# EAGLE design routed-micromouse-board (EAGLE 9.4.2)
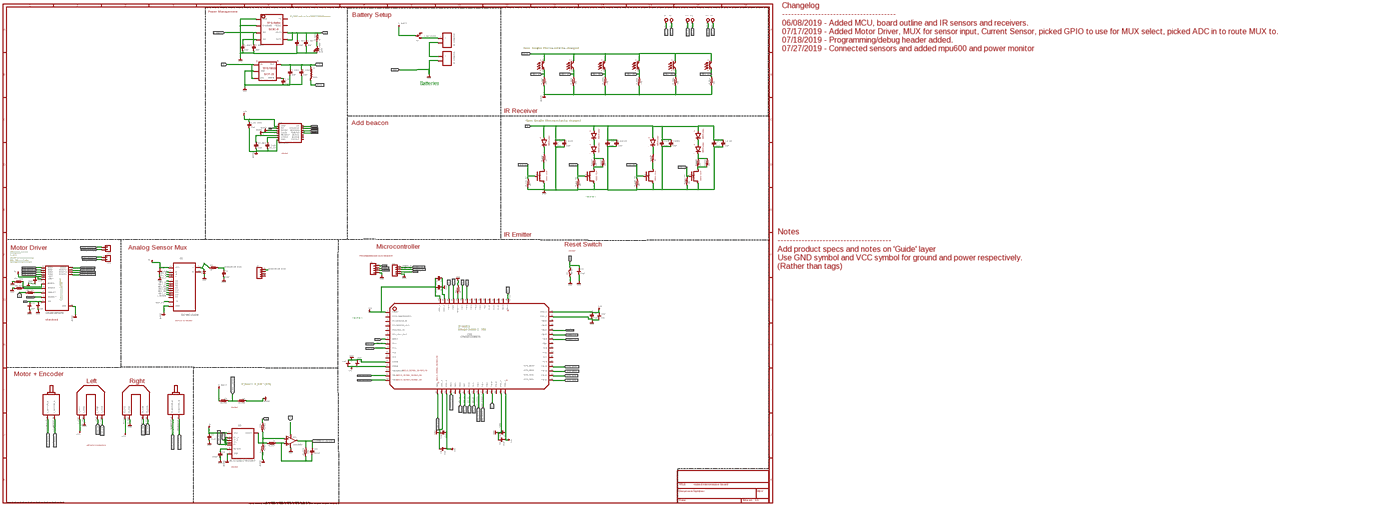
[diagram p0: schematic, sheet 1, overview]
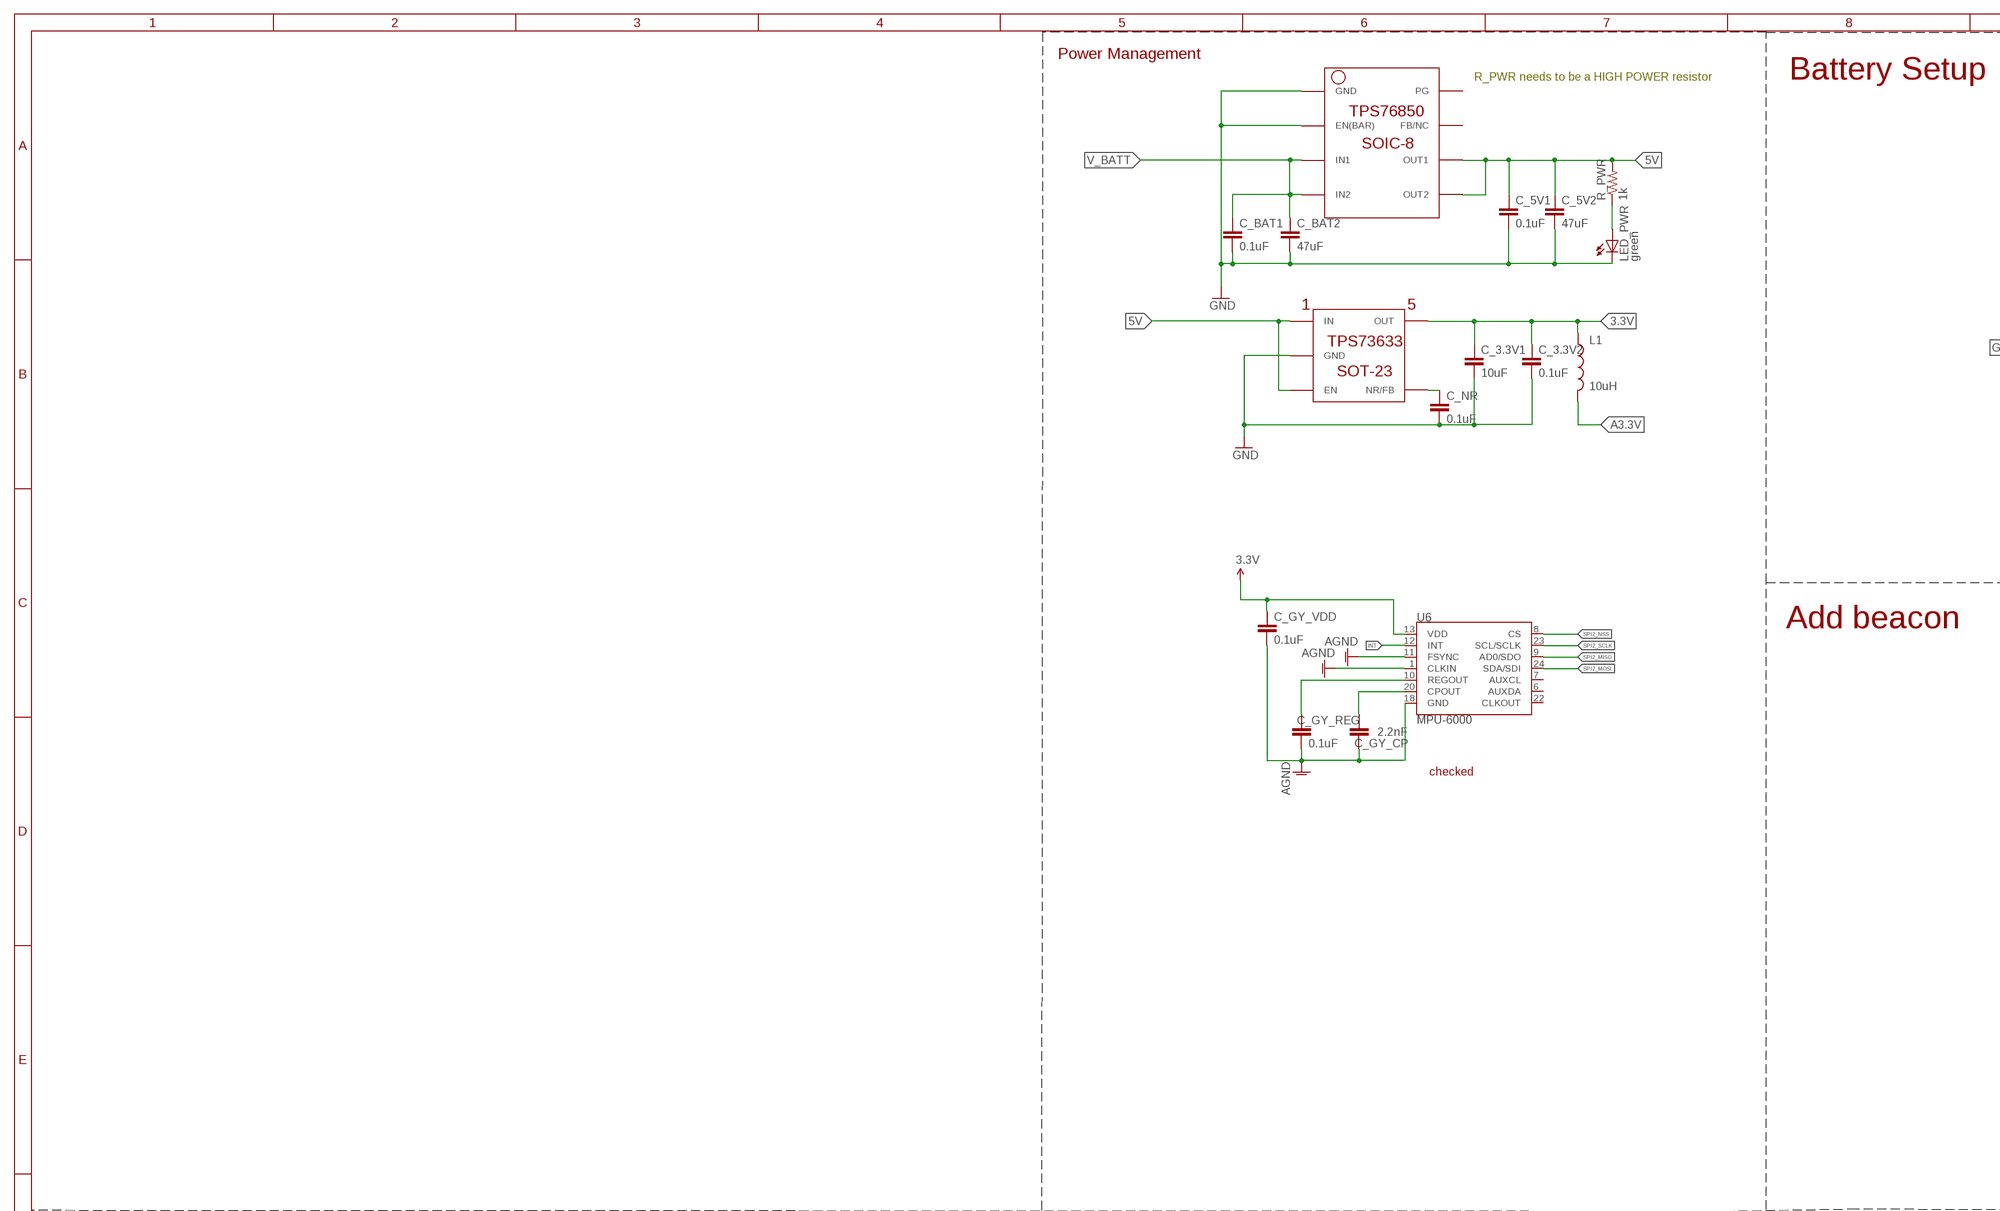
[diagram p1: schematic, sheet 1, part 1 of 6]
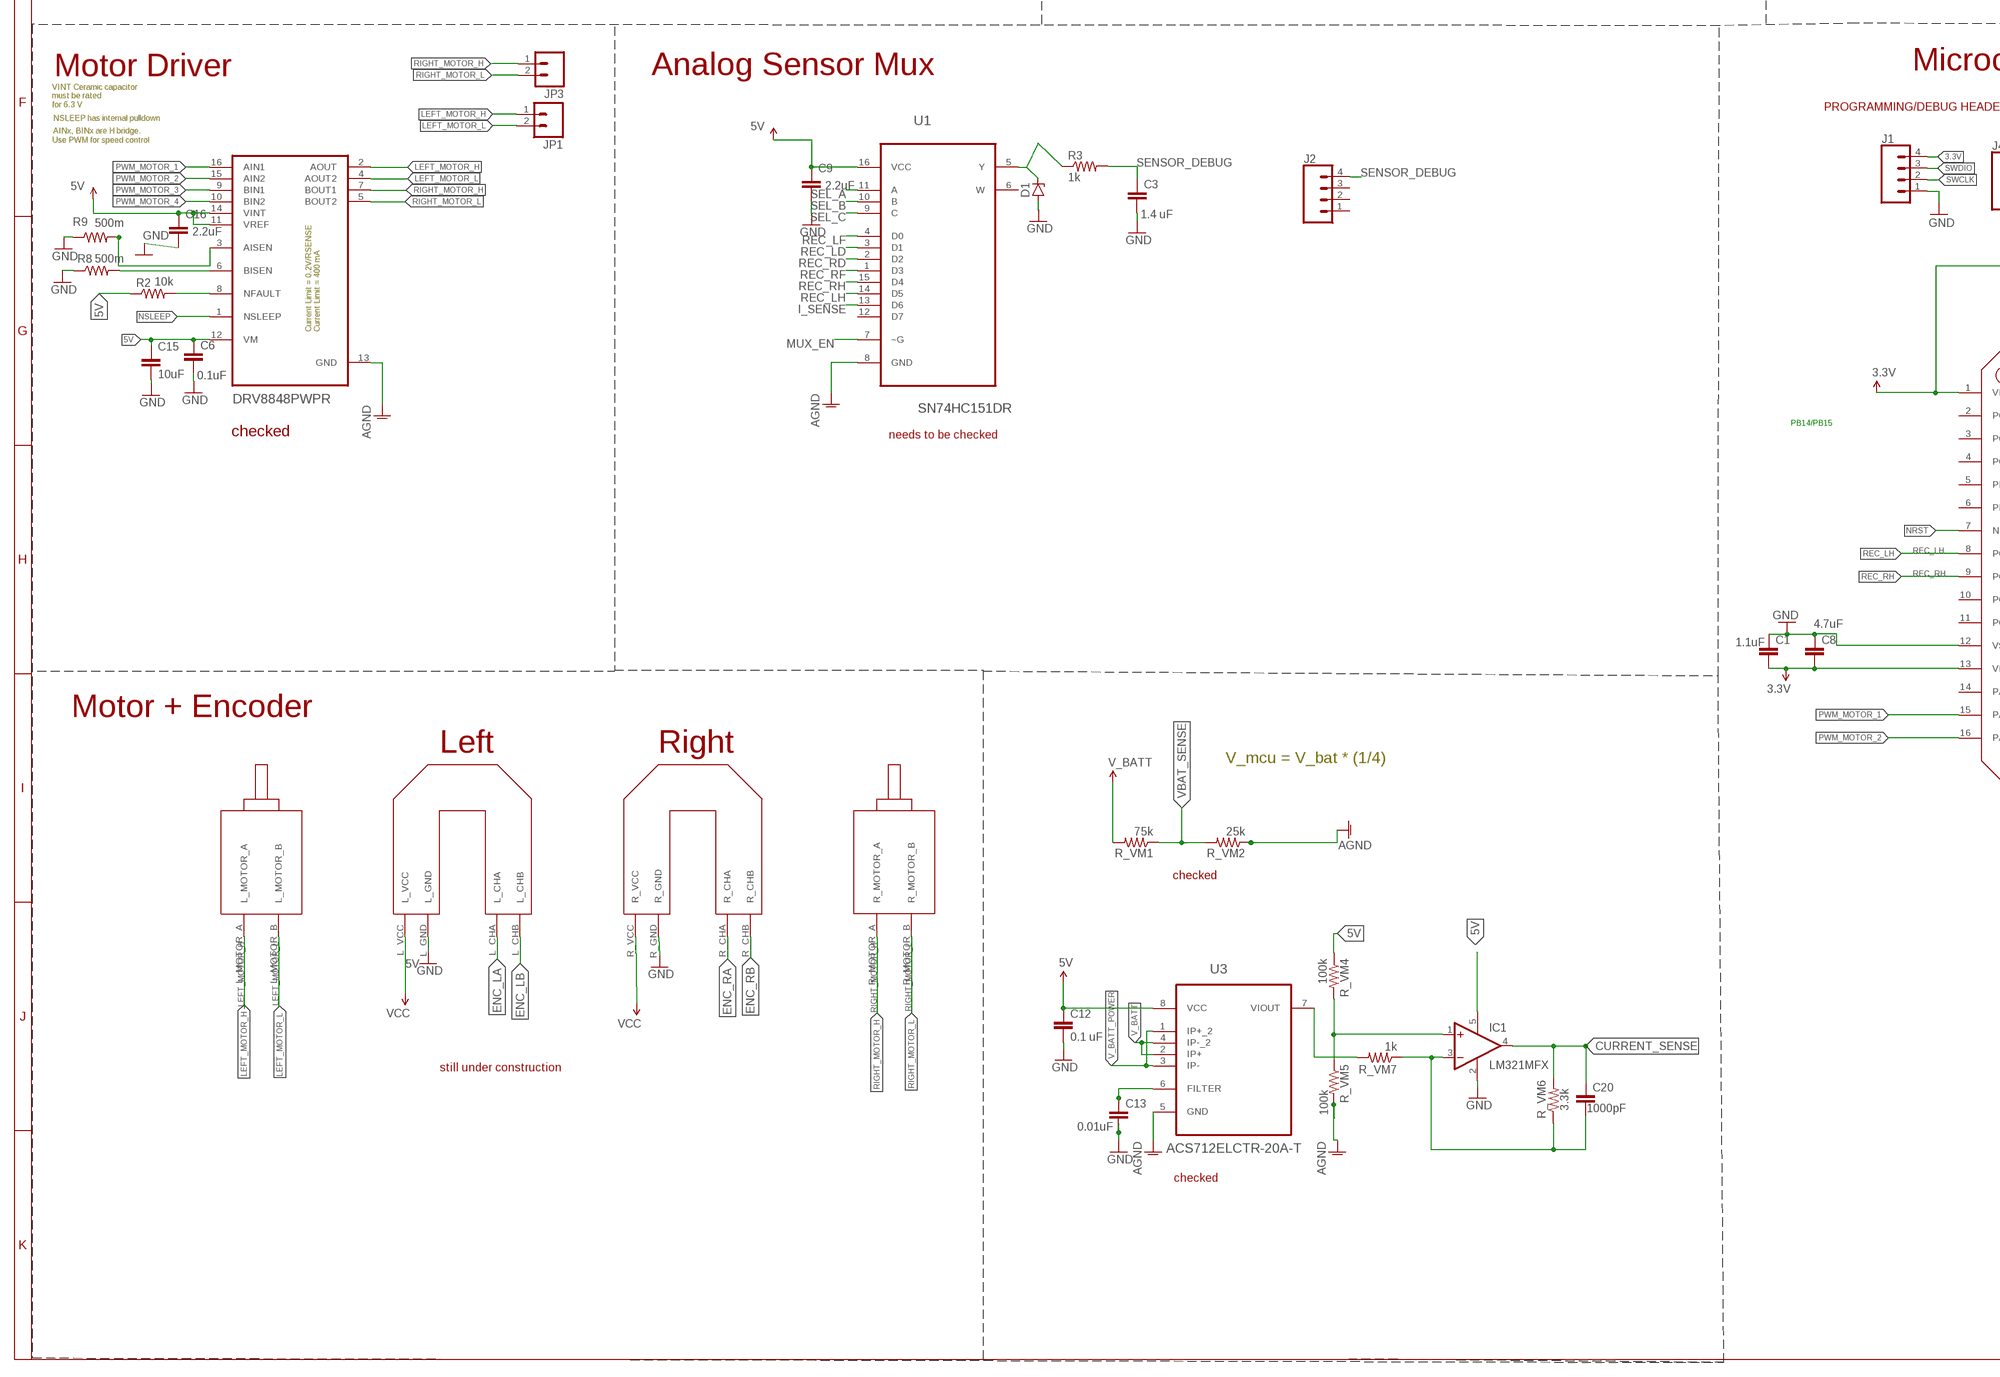
[diagram p2: schematic, sheet 1, part 2 of 6]
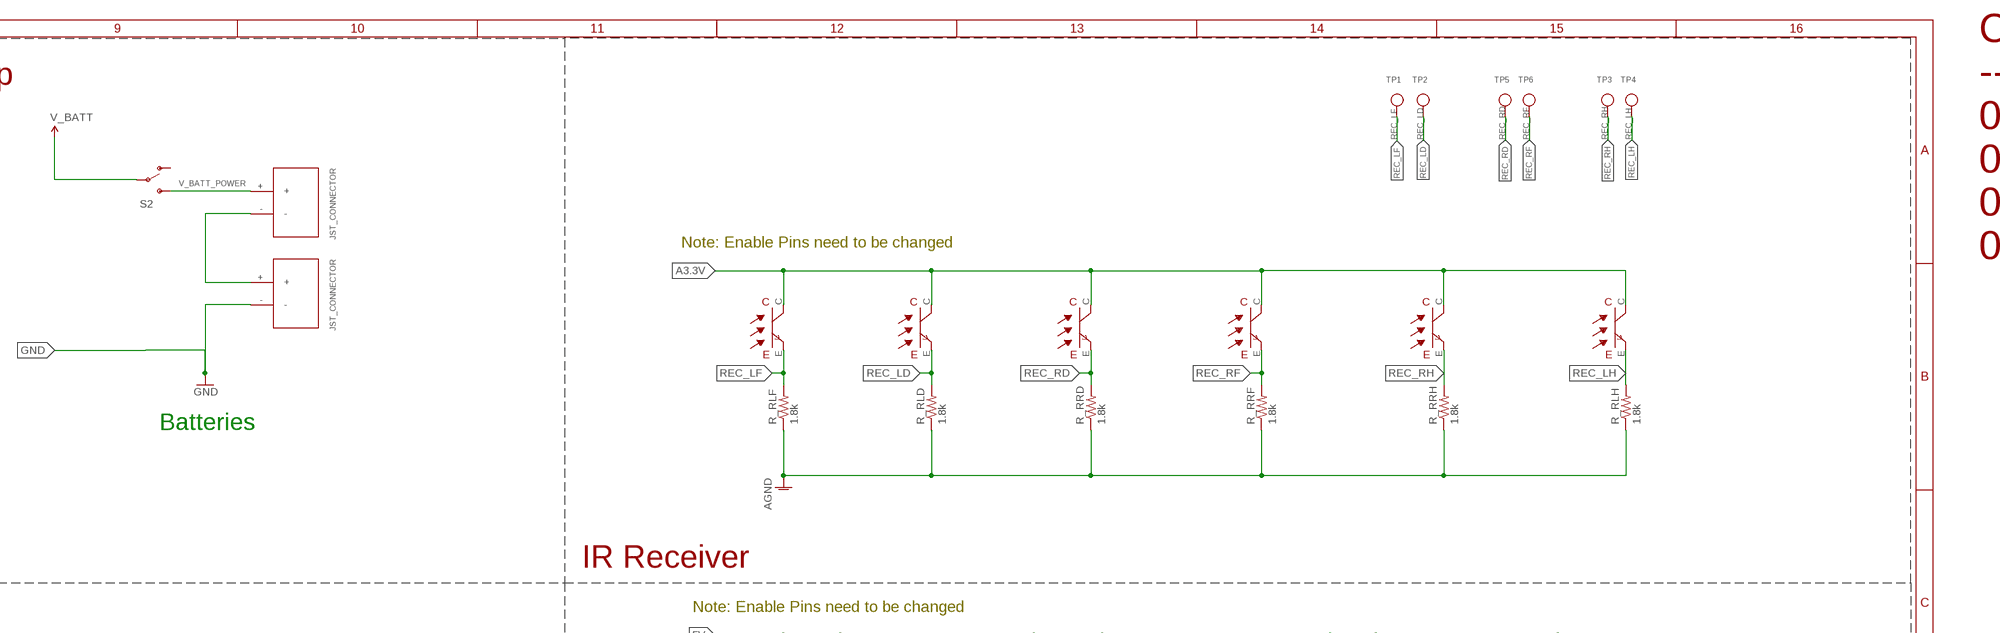
[diagram p3: schematic, sheet 1, part 3 of 6]
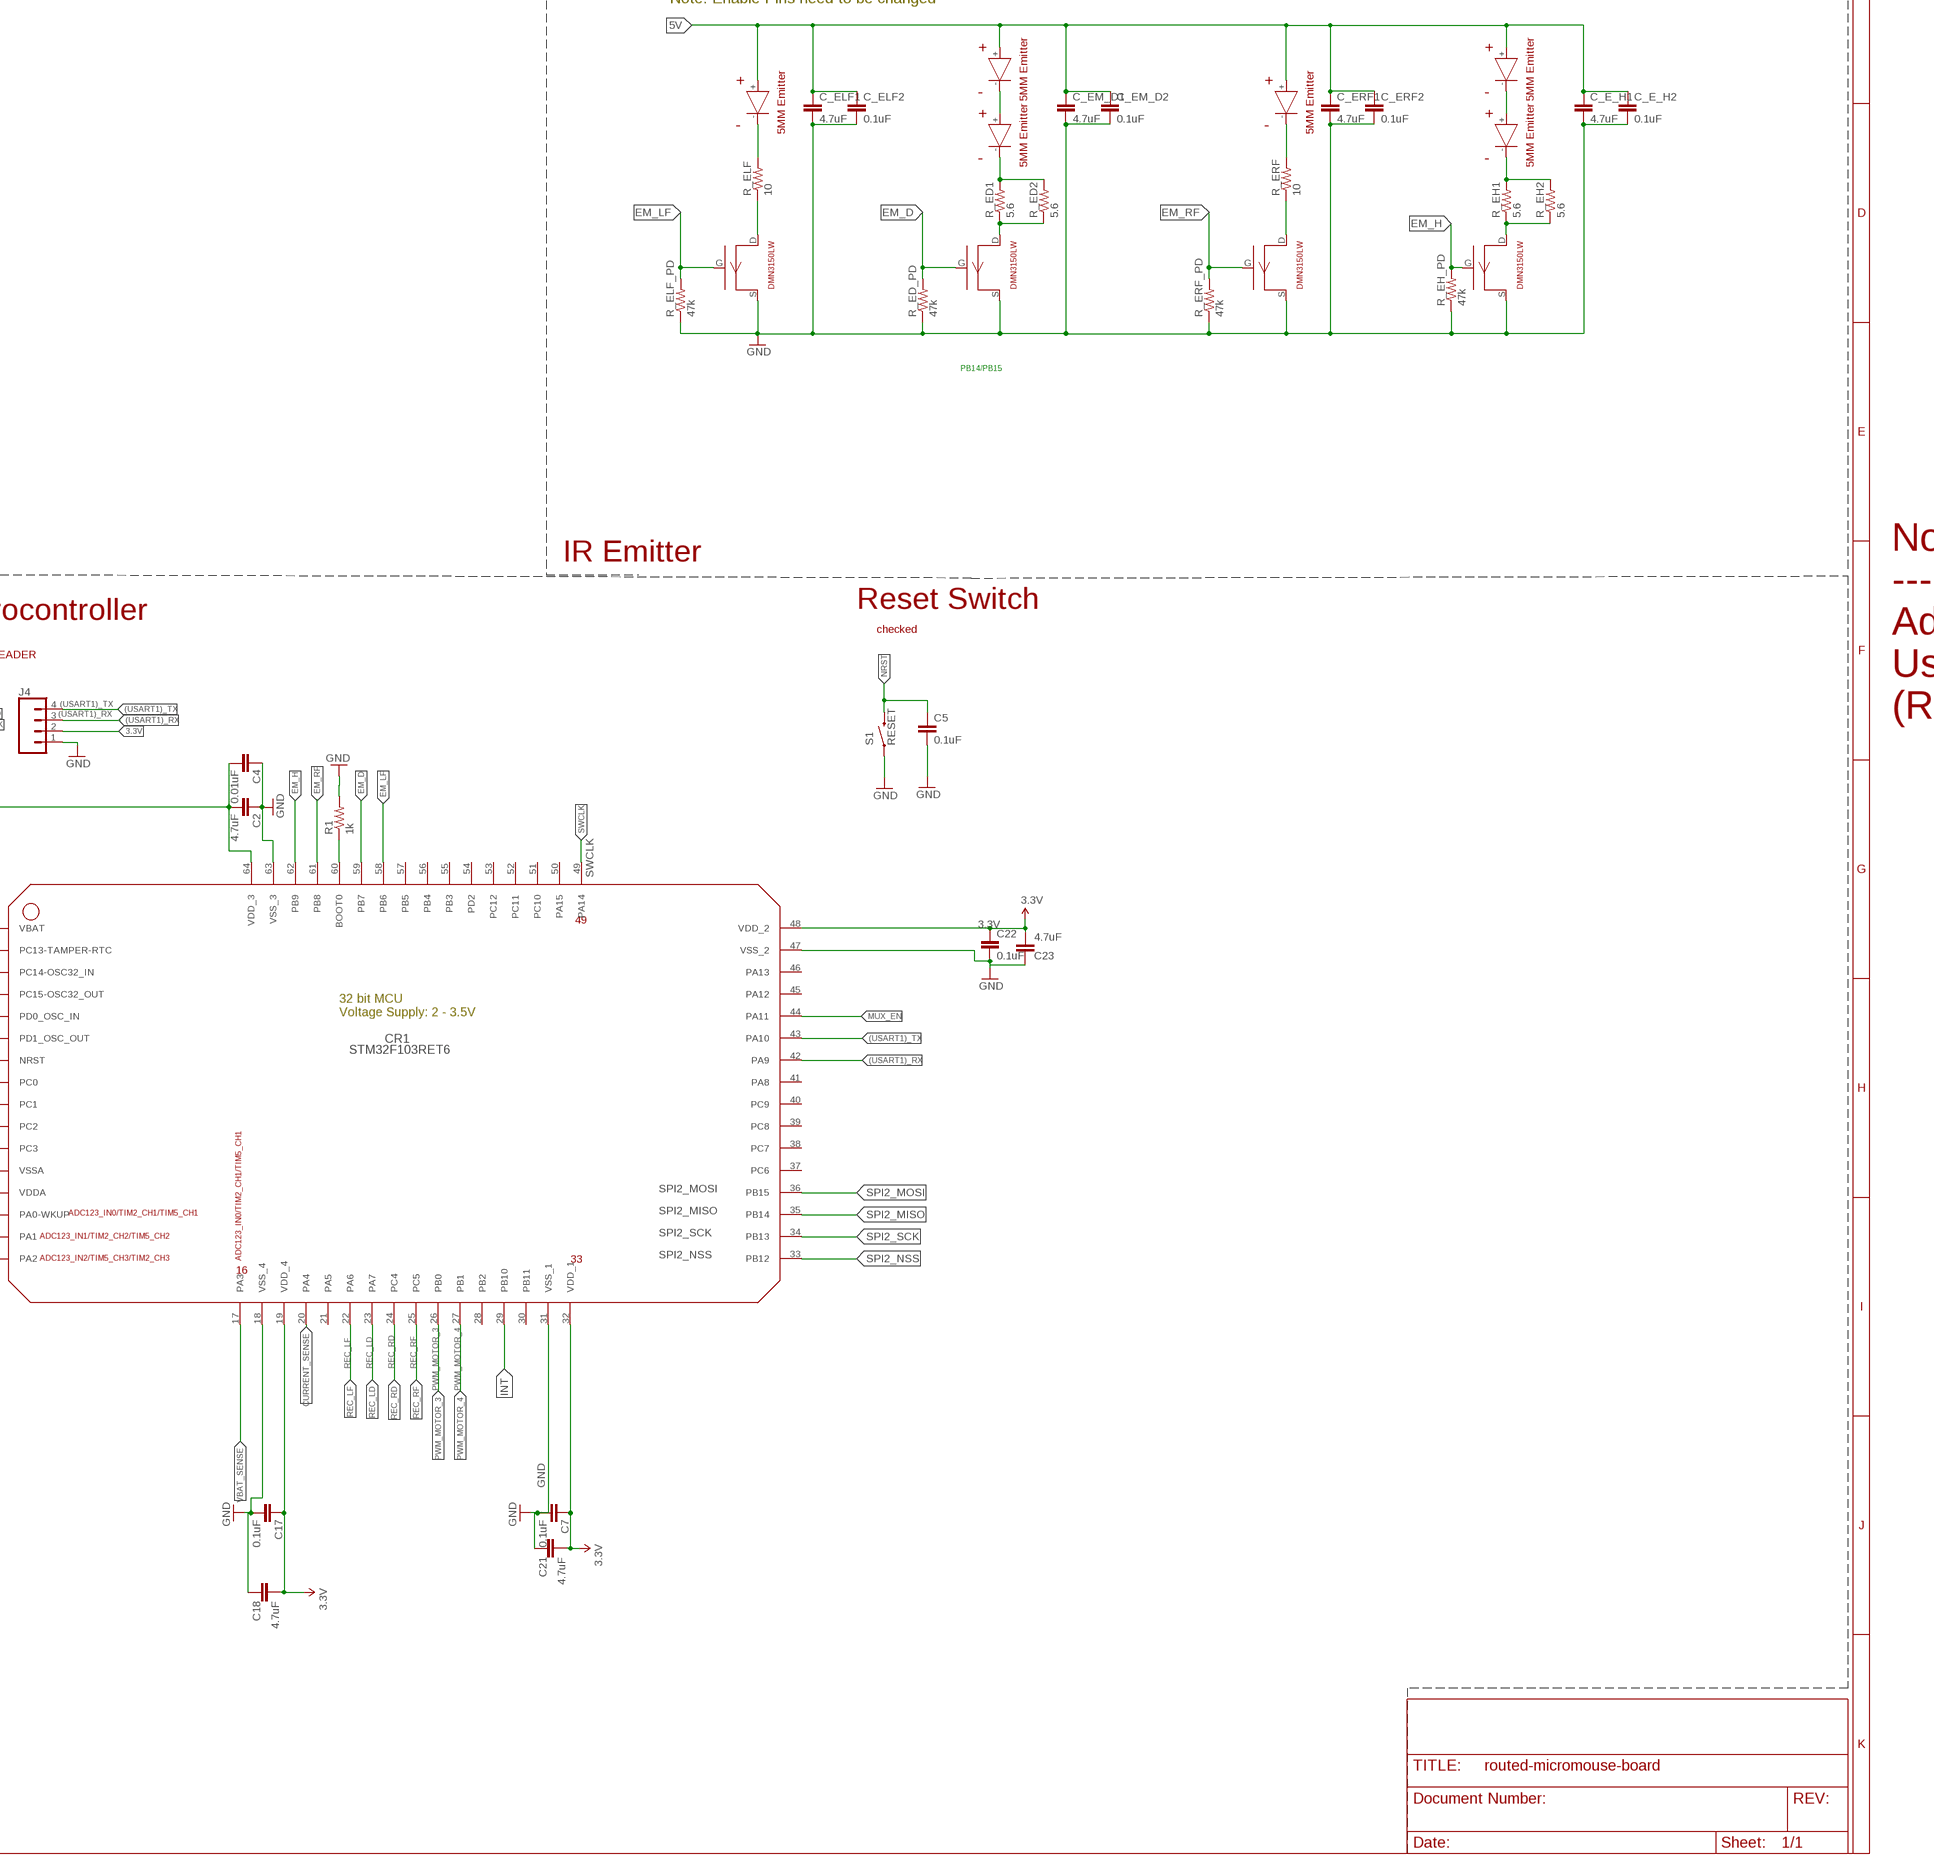
[diagram p4: schematic, sheet 1, part 4 of 6]
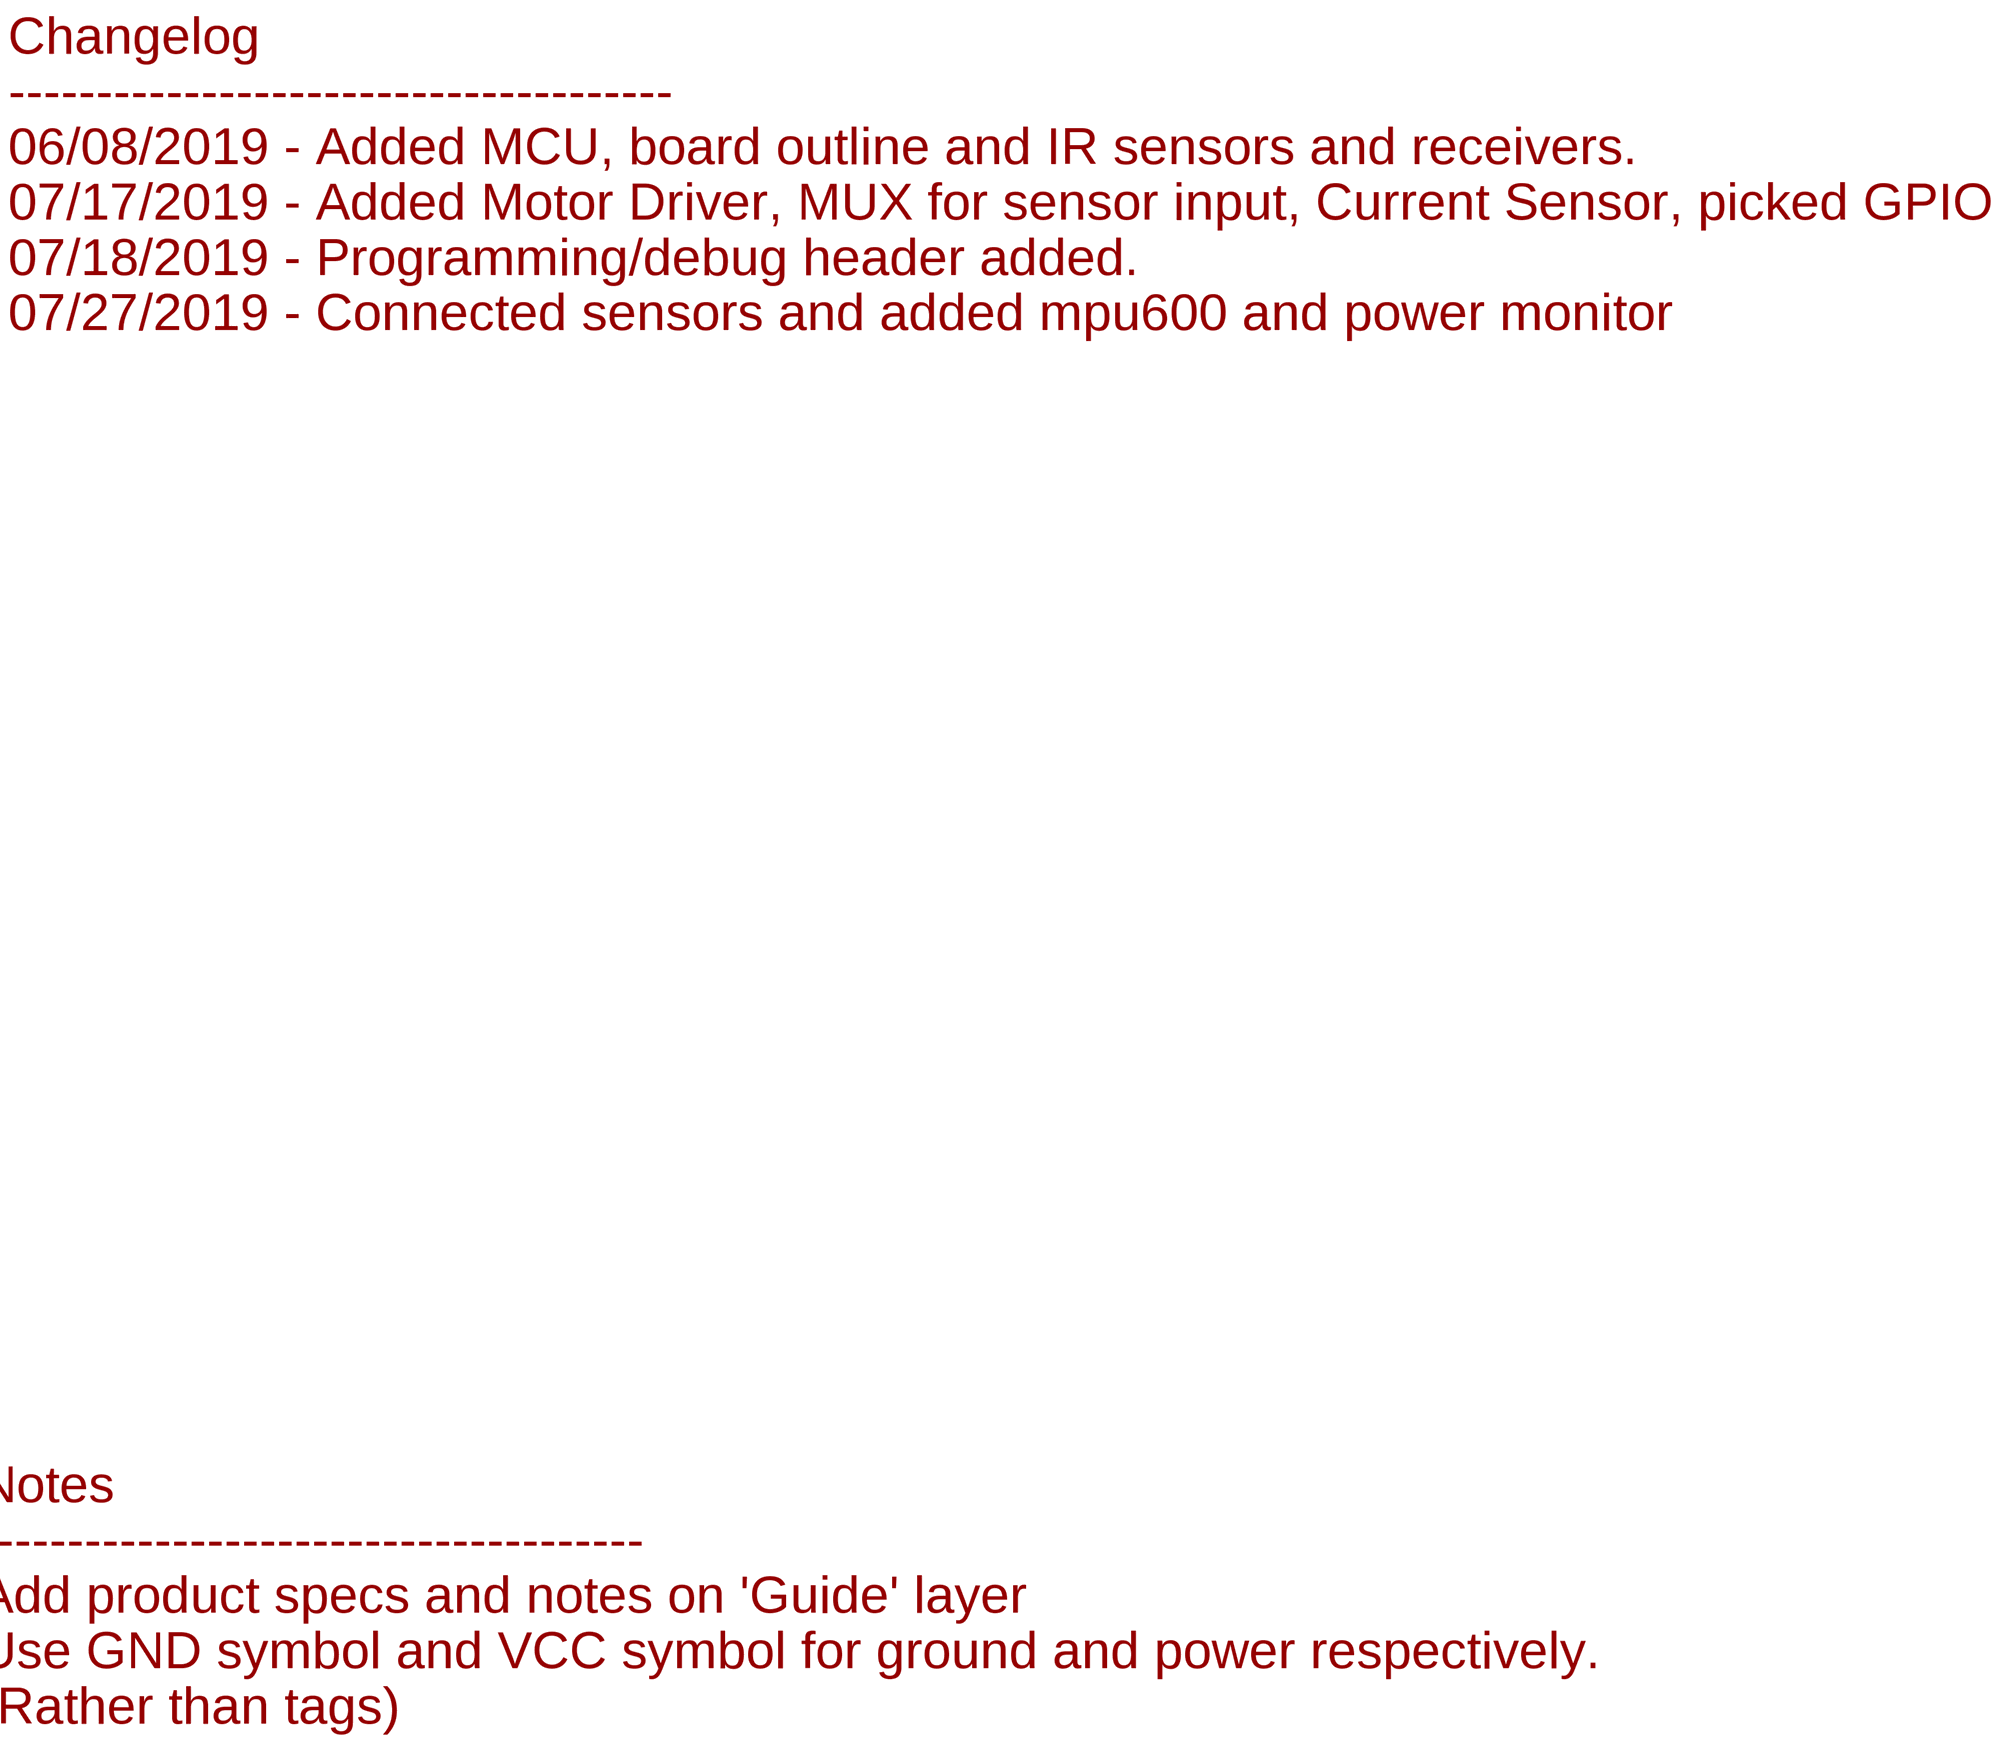
[diagram p5: schematic, sheet 1, part 5 of 6]
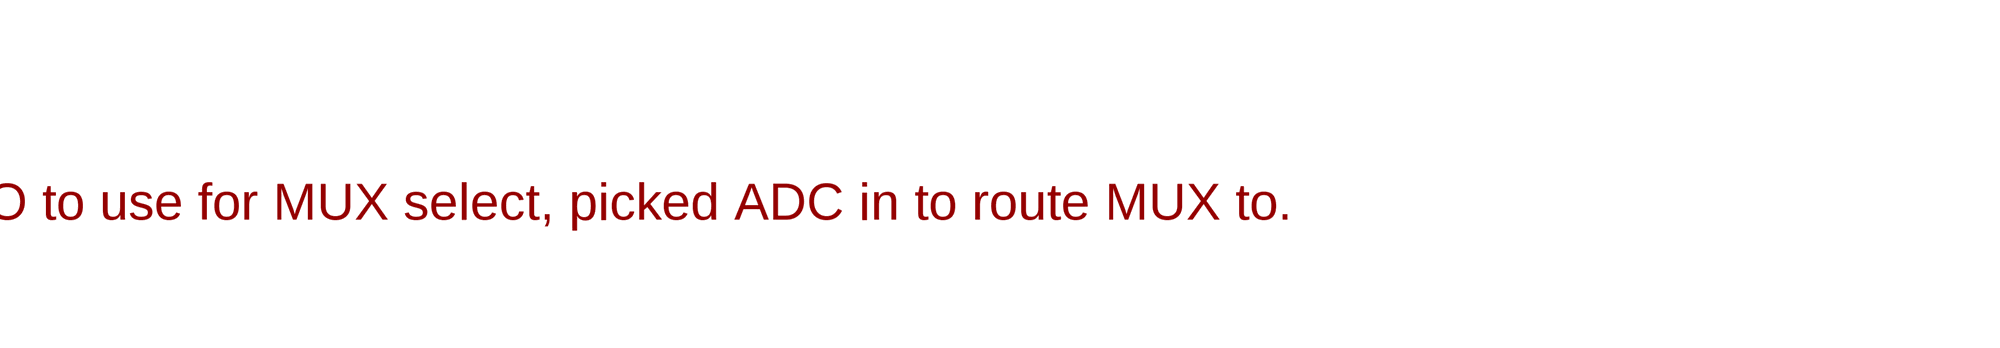
[diagram p6: schematic, sheet 1, part 6 of 6]

## Parts
C1  1.1uF  CAP0603-CAP  [0603-CAP]
C2  4.7uF  CAP0603-CAP  [0603-CAP]
C3  1.4 uF  CAP0603-CAP  [0603-CAP]
C4  0.01uF  CAP0603-CAP  [0603-CAP]
C5  0.1uF  CAP0603-CAP  [0603-CAP]
C6  0.1uF  CAP0603-CAP  [0603-CAP]
C7  0.1uF  CAP0603-CAP  [0603-CAP]
C8  4.7uF  CAP0603-CAP  [0603-CAP]
C9  2.2uF  CAP0603-CAP  [0603-CAP]
C12  0.1 uF  CAP0603-CAP  [0603-CAP]
C13  0.01uF  CAP0603-CAP  [0603-CAP]
C15  10uF  CAP0603-CAP  [0603-CAP]
C16  2.2uF  CAP0603-CAP  [0603-CAP]
C17  0.1uF  CAP0603-CAP  [0603-CAP]
C18  4.7uF  CAP0603-CAP  [0603-CAP]
C20  1000pF  CAP0603-CAP  [0603-CAP]
C21  4.7uF  CAP0603-CAP  [0603-CAP]
C22  0.1uF  CAP0603-CAP  [0603-CAP]
C23  4.7uF  CAP0603-CAP  [0603-CAP]
C_3.3V1  10uF  CAP0603-CAP  [0603-CAP]
C_3.3V2  0.1uF  CAP0603-CAP  [0603-CAP]
C_5V1  0.1uF  CAP0603-CAP  [0603-CAP]
C_5V2  47uF  CAP1210  [1210]
C_BAT1  0.1uF  CAP0603-CAP  [0603-CAP]
C_BAT2  47uF  CAP1210  [1210]
C_E_H1  4.7uF  CAP0603-CAP  [0603-CAP]
C_E_H2  0.1uF  CAP0603-CAP  [0603-CAP]
C_ELF1  4.7uF  CAP0603-CAP  [0603-CAP]
C_ELF2  0.1uF  CAP0603-CAP  [0603-CAP]
C_EM_D1  4.7uF  CAP0603-CAP  [0603-CAP]
C_EM_D2  0.1uF  CAP0603-CAP  [0603-CAP]
C_ERF1  4.7uF  CAP0603-CAP  [0603-CAP]
C_ERF2  0.1uF  CAP0603-CAP  [0603-CAP]
C_GY_CP  2.2nF  CAP0603-CAP  [0603-CAP]
C_GY_REG  0.1uF  CAP0603-CAP  [0603-CAP]
C_GY_VDD  0.1uF  CAP0603-CAP  [0603-CAP]
C_NR  0.1uF  CAP0603-CAP  [0603-CAP]
CR1  STM32F103RET6  [LQFP-64]
D1  ZENER-DIODESOT23  [SOT23]
IC1  LM321MFX  [SOT23-5]
J1  CONN_04  [1X04]
J2  CONN_04  [1X04]
J4  CONN_04  [1X04]
JP1  M02POLAR  [MOLEX-1X2]
JP3  M02POLAR  [MOLEX-1X2]
L1  10uH  INDUCTOR1007  [1007]
LED_PWR  green  LED1206  [LED-1206]
LEFT_FRONT_EMITTER  EMITTER  [EMITTER]
NMOS1  DMN3150LW  [DMN3150LW]
NMOS2  DMN3150LW  [DMN3150LW]
NMOS3  DMN3150LW  [DMN3150LW]
NMOS4  DMN3150LW  [DMN3150LW]
R1  1k  R-US_M0805  [M0805]
R2  10k  RESISTOR0805-RES  [0805]
R3  1k  R-US_R0805  [R0805]
R8  500m  RESISTOR0805-RES  [0805]
R9  500m  RESISTOR0805-RES  [0805]
R_ED1  5.6  RESISTOR0603-RES  [0603-RES]
R_ED2  5.6  RESISTOR0603-RES  [0603-RES]
R_ED_PD  47k  RESISTOR0603-RES  [0603-RES]
R_EH1  5.6  RESISTOR0603-RES  [0603-RES]
R_EH2  5.6  RESISTOR0603-RES  [0603-RES]
R_EH_PD  47k  RESISTOR0603-RES  [0603-RES]
R_ELF  10  RESISTOR0603-RES  [0603-RES]
R_ELF_PD  47k  RESISTOR0603-RES  [0603-RES]
R_ERF  10  RESISTOR0603-RES  [0603-RES]
R_ERF_PD  47k  RESISTOR0603-RES  [0603-RES]
R_PWR  1k  RESISTOR0603-RES  [0603-RES]
R_RLD  1.8k  RESISTOR0603-RES  [0603-RES]
R_RLF  1.8k  RESISTOR0603-RES  [0603-RES]
R_RLH  1.8k  RESISTOR0603-RES  [0603-RES]
R_RRD  1.8k  RESISTOR0603-RES  [0603-RES]
R_RRF  1.8k  RESISTOR0603-RES  [0603-RES]
R_RRH  1.8k  RESISTOR0603-RES  [0603-RES]
R_VM1  75k  RESISTOR0603-RES  [0603-RES]
R_VM2  25k  RESISTOR0603-RES  [0603-RES]
R_VM4  100k  RESISTOR0603-RES  [0603-RES]
R_VM5  100k  RESISTOR0603-RES  [0603-RES]
R_VM6  3.3k  RESISTOR0603-RES  [0603-RES]
R_VM7  1k  RESISTOR0603-RES  [0603-RES]
REC_LF  RECEIVER  [RECEIVER]
S1  RESET  SWITCH-MOMENTARY-2SMD-4.6X2.8MM  [TACTILE_SWITCH_SMD_4.6X2.8MM]
S2  SWITCH-SPSTPTH  [SWITCH-SPDT]
TP1  TESTPOINTROUND2MM  [TESTPOINT_ROUND_2MM]
TP2  TESTPOINTROUND2MM  [TESTPOINT_ROUND_2MM]
TP3  TESTPOINTROUND2MM  [TESTPOINT_ROUND_2MM]
TP4  TESTPOINTROUND2MM  [TESTPOINT_ROUND_2MM]
TP5  TESTPOINTROUND2MM  [TESTPOINT_ROUND_2MM]
TP6  TESTPOINTROUND2MM  [TESTPOINT_ROUND_2MM]
U1  SN74HC151DR  [SOIC127P600X175-16N]
U2  DRV8848PWPR  [SOP65P640X120-17N]
U3  ACS712ELCTR-20A-T  [SOIC127P600X175-8N]
U6  MPU-6000  [QFN-24-EP]
U$1  JST_CONNECTOR_FEMALE  [JST_CONNECTOR_FEMALE]
U$2  JST_CONNECTOR_FEMALE  [JST_CONNECTOR_FEMALE]
U$3  TPS73633(SOT-23)  [TPS73633(SOT-23)]
U$4  TPS76850(SOIC-8)  [TPS76850(SOIC-8)]
U$7  RECEIVER  [RECEIVER]
U$8  RECEIVER  [RECEIVER]
U$9  RECEIVER  [RECEIVER]
U$11  EMITTER  [EMITTER]
U$12  MY_MM_MOTOR_MOUNT  [MY_MM_MOTOR_MOUNT]
U$13  EMITTER  [EMITTER]
U$17  EMITTER  [EMITTER]
U$18  EMITTER  [EMITTER]
U$19  EMITTER  [EMITTER]
U$20  RECEIVER  [RECEIVER]
U$21  RECEIVER  [RECEIVER]

## Nets
3.3V: C1.2 C2.2 C4.2 C7.1 C8.2 C17.1 C18.2 C21.2 C22.1 C23.2 C_3.3V1.1 C_3.3V2.1 C_GY_VDD.1 CR1.1(VBAT) CR1.13(VDDA) CR1.19(VDD_4) CR1.32(VDD_1) CR1.48(VDD_2) CR1.64(VDD_3) J1.4 J4.2 L1.1 U6.13(VDD) U$3.OUT
5V: C6.1 C9.1 C12.1 C15.1 C16.1 C_5V1.1 C_5V2.1 C_E_H1.1 C_E_H2.1 C_ELF1.1 C_ELF2.1 C_EM_D1.1 C_EM_D2.1 C_ERF1.1 C_ERF2.1 IC1.5(V+) LEFT_FRONT_EMITTER.+ R2.1 R_PWR.2 R_VM4.1 U1.16(VCC) U2.11(VREF) U2.12(VM) U2.14(VINT) U3.8(VCC) U$3.EN U$3.IN U$4.OUT1 U$4.OUT2 U$11.+ U$12.L_VCC U$12.R_VCC U$13.+ U$18.+ ; supply symbol labelled VCC
(USART1)_RX: CR1.42(PA9) J4.3
(USART1)_TX: CR1.43(PA10) J4.4
A3.3V: L1.2 REC_LF.C U$7.C U$8.C U$9.C U$20.C U$21.C
AGND: C_GY_CP.2 C_GY_REG.2 C_GY_VDD.2 R_RLD.1 R_RLF.1 R_RLH.1 R_RRD.1 R_RRF.1 R_RRH.1 R_VM2.1 R_VM5.2 U1.8(GND) U2.13(GND) U3.5(GND) U6.1(CLKIN) U6.11(FSYNC) U6.18(GND)
BATT_CONN: U$1.+ U$2.-
CURRENT_SENSE: C20.1 CR1.20(PA4) IC1.4(OUT) R_VM6.2
D2_EM: R_ED1.2 R_ED2.2 U$17.-
D_EM: U$11.- U$17.+
EM_D: CR1.59(PB7) NMOS2.G R_ED_PD.2
EM_H: CR1.62(PB9) NMOS4.G R_EH_PD.2
EM_LF: CR1.58(PB6) NMOS1.G R_ELF_PD.2
EM_RF: CR1.61(PB8) NMOS3.G R_ERF_PD.2
ENC_LA: U$12.L_CHA
ENC_LB: U$12.L_CHB
ENC_RA: U$12.R_CHA
ENC_RB: U$12.R_CHB
GND: C1.1 C2.1 C3.2 C4.1 C5.2 C6.2 C7.2 C8.1 C9.2 C12.2 C13.2 C15.2 C16.2 C17.2 C18.1 C21.1 C22.2 C23.1 C_3.3V1.2 C_3.3V2.2 C_5V1.2 C_5V2.2 C_BAT1.2 C_BAT2.2 C_E_H1.2 C_E_H2.2 C_ELF1.2 C_ELF2.2 C_EM_D1.2 C_EM_D2.2 C_ERF1.2 C_ERF2.2 C_NR.2 CR1.12(VSSA) CR1.18(VSS_4) CR1.31(VSS_1) CR1.47(VSS_2) CR1.63(VSS_3) D1.1(A) IC1.2(V-) J1.1 J4.1 LED_PWR.C NMOS1.S NMOS2.S NMOS3.S NMOS4.S R1.2 R8.1 R9.1 R_ED_PD.1 R_EH_PD.1 R_ELF_PD.1 R_ERF_PD.1 S1.1 S1.2 U$1.- U$3.GND U$4.EN(BAR) U$4.GND U$12.L_GND U$12.R_GND
H2_EM: R_EH1.2 R_EH2.2 U$19.-
H_EM: U$18.- U$19.+
I_SENSE: U1.13(D6)
INT: CR1.29(PB10) U6.12(INT)
LEFT_MOTOR_H: JP1.1 U2.2(AOUT) U$12.L_MOTOR_A
LEFT_MOTOR_L: JP1.2 U2.4(AOUT2) U$12.L_MOTOR_B
LF_EM: LEFT_FRONT_EMITTER.- R_ELF.2
MUX_EN: CR1.44(PA11) U1.7(~G)
N$1: C13.1 U3.6(FILTER)
N$2: D1.3(C) R3.1 U1.5(Y)
N$5: NMOS3.D R_ERF.1
N$7: NMOS1.D R_ELF.1
N$9: CR1.60(BOOT0) R1.1
N$12: R2.2 U2.8(NFAULT)
N$15: R9.2 U2.3(AISEN)
N$18: NMOS2.D R_ED1.1 R_ED2.1
N$19: NMOS4.D R_EH1.1 R_EH2.1
N$20: R8.2 U2.6(BISEN)
N$21: IC1.1(+IN) R_VM4.2 R_VM5.1
N$24: R_VM7.2 U3.7(VIOUT)
N$26: C_NR.1 U$3.NR/FB
N$27: LED_PWR.A R_PWR.1
N$28: C_GY_REG.1 U6.10(REGOUT)
N$29: C_GY_CP.1 U6.20(CPOUT)
N$31: C20.2 IC1.3(-IN) R_VM6.1 R_VM7.1
NRST: C5.1 CR1.7(NRST) S1.3 S1.4
NSLEEP: U2.1(NSLEEP)
PWM_MOTOR_1: CR1.15(PA1) U2.16(AIN1)
PWM_MOTOR_2: CR1.16(PA2) U2.15(AIN2)
PWM_MOTOR_3: CR1.26(PB0) U2.9(BIN1)
PWM_MOTOR_4: CR1.27(PB1) U2.10(BIN2)
REC_LD: CR1.23(PA7) R_RLD.2 TP2.P$1 U1.3(D1) U$7.E
REC_LF: CR1.22(PA6) R_RLF.2 REC_LF.E TP1.P$1 U1.4(D0)
REC_LH: CR1.8(PC0) R_RLH.2 TP4.P$1 U1.14(D5) U$21.E
REC_RD: CR1.24(PC4) R_RRD.2 TP5.P$1 U1.2(D2) U$8.E
REC_RF: CR1.25(PC5) R_RRF.2 TP6.P$1 U1.1(D3) U$9.E
REC_RH: CR1.9(PC1) R_RRH.2 TP3.P$1 U1.15(D4) U$20.E
RF_EM: R_ERF.2 U$13.-
RIGHT_MOTOR_H: JP3.1 U2.7(BOUT1) U$12.R_MOTOR_A
RIGHT_MOTOR_L: JP3.2 U2.5(BOUT2) U$12.R_MOTOR_B
SEL_A: U1.11(A)
SEL_B: U1.10(B)
SEL_C: U1.9(C)
SENSOR_DEBUG: C3.1 J2.4 R3.2
SPI2_MISO: CR1.35(PB14) U6.9(AD0/SDO)
SPI2_MOSI: CR1.36(PB15) U6.24(SDA/SDI)
SPI2_NSS: CR1.33(PB12) U6.8(CS)
SPI2_SCK: CR1.34(PB13)
SPI2_SCLK: U6.23(SCL/SCLK)
SWCLK: CR1.49(PA14) J1.2
SWDIO: J1.3
V_BATT: C_BAT1.1 C_BAT2.1 R_VM1.2 S2.2(P) U3.2(IP+) U3.4(IP-_2) U$4.IN1 U$4.IN2
V_BATT_POWER: S2.3(S) U3.1(IP+_2) U3.3(IP-) U$2.+
VBAT_SENSE: CR1.17(PA3) R_VM1.1 R_VM2.2
Unconnected: CR1.2(PC13-TAMPER-RTC) CR1.3(PC14-OSC32_IN) CR1.4(PC15-OSC32_OUT) CR1.5(PD0_OSC_IN) CR1.6(PD1_OSC_OUT) CR1.10(PC2) CR1.11(PC3) CR1.14(PA0-WKUP) CR1.21(PA5) CR1.28(PB2) CR1.30(PB11) CR1.37(PC6) CR1.38(PC7) CR1.39(PC8) CR1.40(PC9) CR1.41(PA8) CR1.45(PA12) CR1.46(PA13) CR1.50(PA15) CR1.51(PC10) CR1.52(PC11) CR1.53(PC12) CR1.54(PD2) CR1.55(PB3) CR1.56(PB4) CR1.57(PB5) J2.1 J2.2 J2.3 S2.1(O) U1.6(W) U1.12(D7) U6.6(AUXDA) U6.7(AUXCL) U6.22(CLKOUT) U$4.FB/NC U$4.PG

## Notes on the sheet
- Power Management
- R_PWR needs to be a HIGH POWER resistor | Battery Setup
- Note: Enable Pins need to be changed
- Changelog
  --------------------------------------
  06/08/2019 - Added MCU, board outline and IR sensors and receivers.                                      
  07/17/2019 - Added Motor Driver, MUX for sensor input, Current Sensor, picked GPIO to use for MUX select, picked ADC in to route MUX to. 
  07/18/2019 - Programming/debug header added.
  07/27/2019 - Connected sensors and added mpu600 and power monitor
- Batteries
- IR Receiver
- Note: Enable Pins need to be changed
- Add beacon
- checked
- PB14/PB15
- IR Emitter
- Reset Switch
- Motor Driver | Analog Sensor Mux | Microcontroller
- checked
- VINT Ceramic capacitor 
  must be rated 
  for 6.3 V
- PROGRAMMING/DEBUG HEADER
- NSLEEP has internal pulldown
- AINx, BINx are H bridge.
- Use PWM for speed control
- Notes
  --------------------------------------
  Add product specs and notes on 'Guide' layer
  Use GND symbol and VCC symbol for ground and power respectively.
  (Rather than tags)
- Current Limit = 0.2V/RSENSE
  Current Limit = 400 mA
- PB14/PB15
- checked | needs to be checked
- 32 bit MCU
  Voltage Supply: 2 - 3.5V
- ADC123_IN0/TIM2_CH1/TIM5_CH1
- Motor + Encoder | ADC123_IN1/TIM2_CH2/TIM5_CH2
- ADC123_IN2/TIM5_CH3/TIM2_CH3 | ADC123_IN0/TIM2_CH1/TIM5_CH1
- V_mcu = V_bat * (1/4)
- checked
- still under construction
- checked

## Library data of the parts
C1-C9 C12 C13 C15-C18 C20-C23 C_E_H1 C_E_H2 C_ELF1 C_ELF2 C_EM_D1 C_EM_D2 C_ERF1 C_ERF2 = MicromouseV0.0.4:CAP: Capacitor Standard 0603 ceramic capacitor, and 0.1" leaded capacitor.
C_3.3V1 C_3.3V2 C_5V1 C_5V2 C_BAT2 C_GY_CP C_GY_REG C_GY_VDD C_NR = SparkFun:CAP: Capacitor Standard 0603 ceramic capacitor, and 0.1" leaded capacitor.
C_BAT1 = SparkFun-Capacitors:CAP: Capacitor Standard 0603 ceramic capacitor, and 0.1" leaded capacitor.
CR1 = MicromouseV0.0.4:STM32F103RET6; MANUFACTURER_PART_NUMBER: STM32F103RET6; VENDOR: STMicroelectronics
D1 = diode:ZENER-DIODE: Z-Diode
IC1 = linear:LM321?*: Low Power Single Op Amp Source: http://cache.national.com/ds/LM/LM321.pdf
J1 J4 = MicromouseV0.0.4:CONN_04: Multi connection point. Often used as Generic Header-pin footprint for 0.1 inch spaced/style header connections On any of the 0.1 inch spaced packages, you can populate with these: Break Away Headers - Straight <https://www.sparkfun.com/products/116> (PRT-00116) Break Away Male Headers - Right Angle <https://www.sparkfun.com/products/553> (PRT-00553) Female Headers <https://www.sparkfun.com/products/115> (PRT-00115) Break Away Headers - Machine Pin <https://www.sparkfun.com/products/117> (PRT-00117) Break Away Female Headers - Swiss Machine Pin <https://www.sparkfun.com/products/743> (PRT-00743) For SCREWTERMINALS and SPRING TERMINALS visit here: Screw Terimnals on SparkFun.com <https://www.sparkfun.com/search/results?term=Screw+Terminals> (5mm/3.5mm/2.54mm spacing) This device is also useful as a general connection point to wire up your design to another part of your project. Our various solder wires solder well into these plated through hole pads. Hook-Up Wire - Assortment (Stranded, 22 AWG) <https://www.sparkfun.com/products/11375> (PRT-11375) Hook-Up Wire - Assortment (Solid Core, 22 AWG) <https://www.sparkfun.com/products/11367> (PRT-11367) View the entire wire category on our website here <https://www.sparkfun.com/categories/141> Special notes: Molex polarized connector foot print use with SKU : PRT-08231 with associated crimp pins and housings. 1MM SMD Version SKU: PRT-10208; PROD_ID: CONN-09696
J2 = SparkFun-Connectors:CONN_04: Multi connection point. Often used as Generic Header-pin footprint for 0.1 inch spaced/style header connections On any of the 0.1 inch spaced packages, you can populate with these: Break Away Headers - Straight <https://www.sparkfun.com/products/116> (PRT-00116) Break Away Male Headers - Right Angle <https://www.sparkfun.com/products/553> (PRT-00553) Female Headers <https://www.sparkfun.com/products/115> (PRT-00115) Break Away Headers - Machine Pin <https://www.sparkfun.com/products/117> (PRT-00117) Break Away Female Headers - Swiss Machine Pin <https://www.sparkfun.com/products/743> (PRT-00743) For SCREWTERMINALS and SPRING TERMINALS visit here: Screw Terimnals on SparkFun.com <https://www.sparkfun.com/search/results?term=Screw+Terminals> (5mm/3.5mm/2.54mm spacing) This device is also useful as a general connection point to wire up your design to another part of your project. Our various solder wires solder well into these plated through hole pads. Hook-Up Wire - Assortment (Stranded, 22 AWG) <https://www.sparkfun.com/products/11375> (PRT-11375) Hook-Up Wire - Assortment (Solid Core, 22 AWG) <https://www.sparkfun.com/products/11367> (PRT-11367) View the entire wire category on our website here <https://www.sparkfun.com/categories/141> Special notes: Molex polarized connector foot print use with SKU : PRT-08231 with associated crimp pins and housings. 1MM SMD Version SKU: PRT-10208; PROD_ID: CONN-09696
JP1 JP3 = EGSE_SIMv0.0.3:M02: Header 2 Standard 2-pin 0.1" header. Use with straight break away headers (SKU : PRT-00116), right angle break away headers (PRT-00553), swiss pins (PRT-00743), machine pins (PRT-00117), and female headers (PRT-00115). Molex polarized connector foot print use with SKU : PRT-08233 with associated crimp pins and housings.
L1 = SparkFun-Passives:INDUCTOR: Inductors Basic Inductor/Choke - 0603 and 1206. Footprints are not proven and vary greatly between part numbers. INDUCTOR POWER 3.3UH 4.0A SMD 0.197" L x 0.197" W x 0.177" H (5.00mm x 5.00mm x 4.50mm)
LED_PWR = SparkFun:LED: LEDs Standard schematic elements and footprints for 5mm, 3mm, 1206, and 0603 sized LEDs. 5mm - Spark Fun Electronics SKU : COM-00529 (and others)
LEFT_FRONT_EMITTER U$11 U$13 U$17-U$19 = MicromouseV0.0.4:EMITTER
NMOS1-NMOS4 = MicromouseV0.0.4:DMN3150LW
R1 R3 = rcl:R-US_: RESISTOR, American symbol; SPICEPREFIX: R
R2 R8 R9 R_ED1 R_ED2 R_ED_PD R_EH1 R_EH2 R_EH_PD R_ELF R_ELF_PD R_ERF R_ERF_PD R_RLD R_RLF R_RLH R_RRD R_RRF R_RRH = MicromouseV0.0.4:RESISTOR: Resistor Basic schematic elements and footprints for 0603, 1206, and PTH resistors.
R_PWR R_VM1 R_VM2 R_VM4-R_VM7 = SparkFun-Passives:RESISTOR: Resistor Basic schematic elements and footprints for 0603, 1206, and PTH resistors.
REC_LF U$7-U$9 U$20 U$21 = MicromouseV0.0.4:RECEIVER
S1 = SparkFun-Electromechanical:SWITCH-MOMENTARY-2: Various NO switches- pushbuttons, reed, etc; PROD_ID: SWCH-13065
S2 = SparkFun:SWITCH-SPST: SPST Switch Simple slide switch. Spark Fun Electronics SKU : COM-00102
TP1-TP6 = microbuilder:TESTPOINT: Test Point Various test points for characterisation and PCB testing TESTPOINT_SMT - Compact Surface Mount Test Point [Digikey: 5016KTR-ND]
U1 = MicromouseV0.0.4:SN74HC151DR: 8-Line to 1-Line Dataselectors /MultiPlexers; AVAILABILITY: Unavailable; DESCRIPTION: 8-Line To 1-Line Data Selectors/Multiplexers 16-SOIC -40 to 85; MF: Texas Instruments; MP: SN74HC151DR; PACKAGE: SOIC-16 Texas Instruments; PRICE: None
U2 = MicromouseV0.0.4:DRV8848PWPR: None; AVAILABILITY: Unavailable; DESCRIPTION: 2A Dual H-Bridge Motor Driver _PWM Control_ 16-HTSSOP -40 to 85; MF: Texas Instruments; MP: DRV8848PWPR; PACKAGE: HTSSOP-16 Texas Instruments; PRICE: None
U3 = MicromouseV0.0.4:ACS712ELCTR-20A-T: Linear Current Sensor; AVAILABILITY: Unavailable; DESCRIPTION: Fully Integrated, Hall Effect-Based Linear Current Sensor IC with 2.1 kVRMS Voltage Isolation and a Low-Resistance Cu...; MF: Allegro; MP: ACS712ELCTR-20A-T; PACKAGE: SOIC-8 Allegro MicroSystems LLC; PRICE: None
U6 = SparkFun-Sensors:MPU-6000: Invensense MPU-6000 6-Axis Gryoscope/Accelerometer 3-axis gyroscope, 3-axis accelerometer in a 4x4 package. The MPU-6000 is the world’s first 6-axis I²C MotionTracking device designed for the low power, low cost, and high performance requirements of smartphones, tablets and wearable sensors. Datasheet <http://cdn.sparkfun.com/datasheets/Components/General%20IC/PS-MPU-6000A.pdf> SparkFun Products MPU-6000 - Motion Processing Unit <https://www.sparkfun.com/products/11234> (SEN-11234) SparkFun UDB5 - PIC UAV Development Board <https://www.sparkfun.com/products/11703> (GPS-11703); PROD_ID: IC-11089; SF_ID: SEN-11234
U$1 U$2 = JST_CONNECTOR_FEMALE. through hole:JST_CONNECTOR_FEMALE
U$3 = TPS73633(SOT-23):TPS73633(SOT-23)
U$4 = TPS76850(SOIC-8):TPS76850(SOIC-8)
U$12 = MicromouseV0.0.4:MY_MM_MOTOR_MOUNT

## Net classes
0 default: width 0.254 mm, drill 0.178 mm, clearance 0.178 mm

## Board
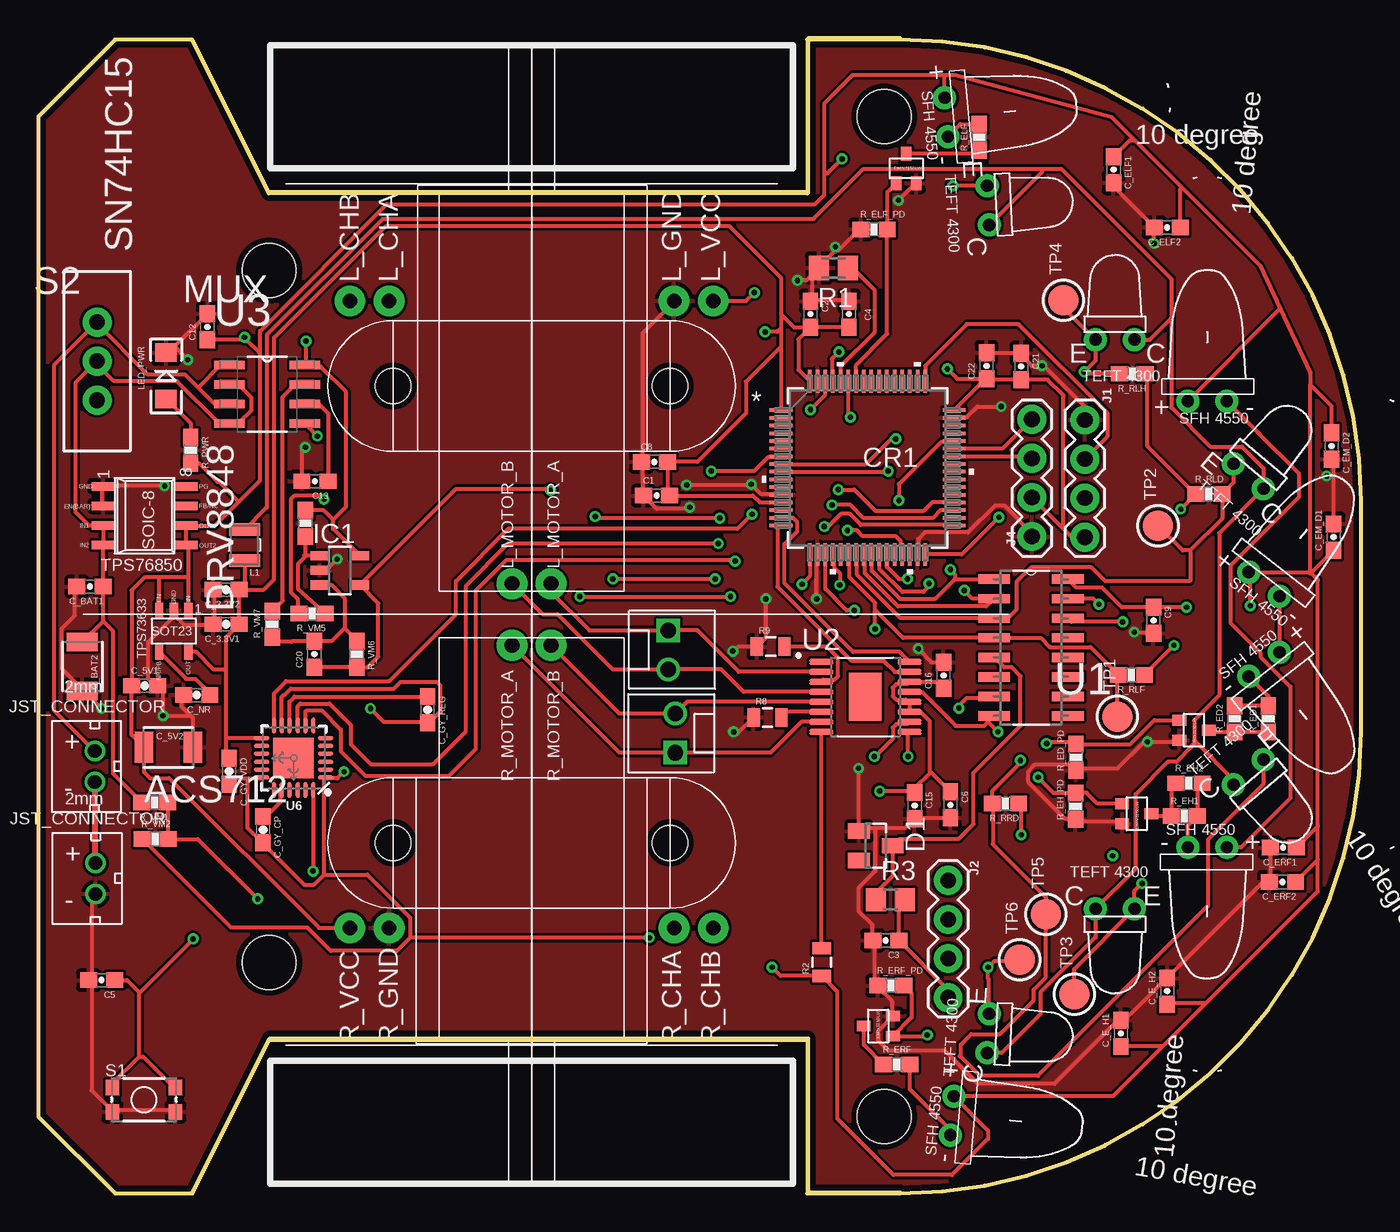
[diagram p7: board, top side]
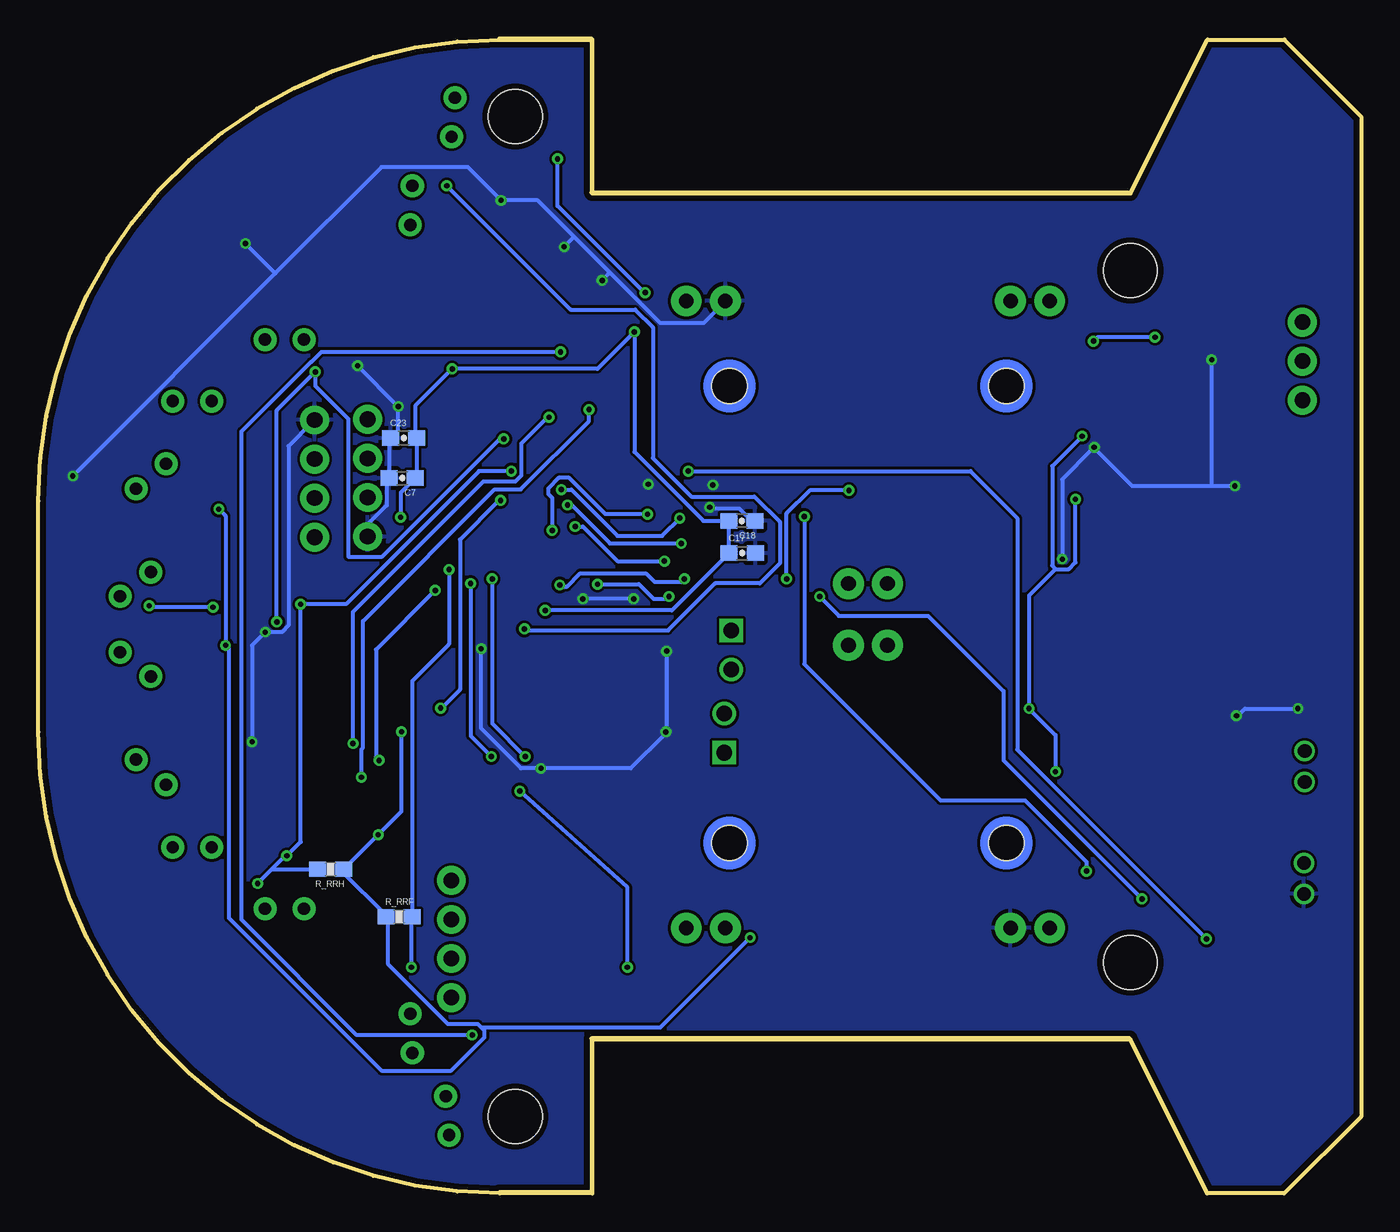
[diagram p8: board, bottom side, seen from below]

Size 86 x 75 mm. Coordinates in mm from the lower left corner, seen from the top.
Outline: 50,10 50,0 56,0 arc90 86,30 86,45 arc90 56,75 50,75 50,65 15,65 9.99,75 4.98,75 0,70 0,5 5,0 10,0 15,10 50,10
Copper layers (1*16): Top 0.0356mm / dielectric 1.5011mm / Bottom 0.0356mm
Design rules "LaenPCBOrder": minimum track width 6mil, minimum drill 13mil, track to track 6mil, track to pad 6mil, pad to pad 6mil, via to via 6mil, smd to smd 6mil, copper to edge 15mil, drill to drill 6mil, minimum pad ring 7mil, minimum via ring 7mil, stop-mask expansion 3mil, vias tented up to drill 0mil, thermal gap 10mil
Holes 3.5 mm at 15,15 55,5 55,70 15,60

### Footprints (pad centres in the part's own frame; a part is rotated, then mirrored left to right if it is on the bottom)
0603-CAP = smd 1.1 x 1: 1 -0.85,0; 2 0.85,0
1210 = smd 1.2 x 2: 1 -1.6,0; 2 1.6,0
LQFP-64 = smd 1.473 x 0.229: 1 -5.626,3.75; 2 -5.626,3.25; 3 -5.626,2.75; 4 -5.626,2.25; 5 -5.626,1.75; 6 -5.626,1.25; 7 -5.626,0.75; 8 -5.626,0.25; 9 -5.626,-0.25; 10 -5.626,-0.75; 11 -5.626,-1.25; 12 -5.626,-1.75; 13 -5.626,-2.25; 14 -5.626,-2.75; 15 -5.626,-3.25; 16 -5.626,-3.75; 33 5.626,-3.75; 34 5.626,-3.25; 35 5.626,-2.75; 36 5.626,-2.25; 37 5.626,-1.75; 38 5.626,-1.25; 39 5.626,-0.75; 40 5.626,-0.25; 41 5.626,0.25; 42 5.626,0.75; 43 5.626,1.25; 44 5.626,1.75; 45 5.626,2.25; 46 5.626,2.75; 47 5.626,3.25; 48 5.626,3.75 | smd 0.229 x 1.473: 17 -3.75,-5.626; 18 -3.25,-5.626; 19 -2.75,-5.626; 20 -2.25,-5.626; 21 -1.75,-5.626; 22 -1.25,-5.626; 23 -0.75,-5.626; 24 -0.25,-5.626; 25 0.25,-5.626; 26 0.75,-5.626; 27 1.25,-5.626; 28 1.75,-5.626; 29 2.25,-5.626; 30 2.75,-5.626; 31 3.25,-5.626; 32 3.75,-5.626; 49 3.75,5.626; 50 3.25,5.626; 51 2.75,5.626; 52 2.25,5.626; 53 1.75,5.626; 54 1.25,5.626; 55 0.75,5.626; 56 0.25,5.626; 57 -0.25,5.626; 58 -0.75,5.626; 59 -1.25,5.626; 60 -1.75,5.626; 61 -2.25,5.626; 62 -2.75,5.626; 63 -3.25,5.626; 64 -3.75,5.626
SOT23 = smd 1 x 1.4: 1 -0.95,-1.1; 2 0.95,-1.1; 3 0,1.1
SOT23-5 = smd 0.6 x 1.2: 1 -0.95,-1.306; 2 0,-1.306; 3 0.95,-1.306; 4 0.95,1.306; 5 -0.95,1.306
1X04 = drill 1.016 pad 1.88: 1 0,0; 2 2.54,0; 3 5.08,0; 4 7.62,0
MOLEX-1X2 = drill 1.016 square: 1 0,0 | drill 1.016: 2 2.54,0
1007 = smd 2 x 0.8: 1 0,1; 2 0,-1
LED-1206 = smd 1.2 x 1.4: A -1.5,0; C 1.5,0
EMITTER = drill 0.8 pad 1.5: + -1.27,-0.5; - 1.27,-0.5
DMN3150LW = smd 0.7 x 0.9: D 0,0.95; G -0.65,-0.95; S 0.65,-0.95
M0805 = smd 1.3 x 1.6: 1 -0.95,0; 2 0.95,0
0805 = smd 0.8 x 1.2: 1 -0.9,0; 2 0.9,0
R0805 = smd 1.3 x 1.5: 1 -0.95,0; 2 0.95,0
0603-RES = smd 1.1 x 1: 1 -0.85,0; 2 0.85,0
RECEIVER = drill 0.8 pad 1.5: C 1.27,-0.5; E -1.27,-0.5
TACTILE_SWITCH_SMD_4.6X2.8MM = smd 0.9 x 1: 1 -2.05,-0.8; 2 2.05,-0.8; 3 2.05,0.8; 4 -2.05,0.8
SWITCH-SPDT = drill 1.016 pad 1.88: 1 0,2.54; 2 0,0; 3 0,-2.54
TESTPOINT_ROUND_2MM = smd 2 x 2: P$1 0,0
SOIC127P600X175-16N = smd 2.057 x 0.61: 1 -4.801,8.89; 2 -4.801,7.62; 3 -4.801,6.35; 4 -4.801,5.08; 5 -4.801,3.81; 6 -4.801,2.54; 7 -4.801,1.27; 8 -4.801,0; 9 0,0; 10 0,1.27; 11 0,2.54; 12 0,3.81; 13 0,5.08; 14 0,6.35; 15 0,7.62; 16 0,8.89
SOP65P640X120-17N = smd 1.57 x 0.41: 1 -2.87,2.275; 2 -2.87,1.625; 3 -2.87,0.975; 4 -2.87,0.325; 5 -2.87,-0.325; 6 -2.87,-0.975; 7 -2.87,-1.625; 8 -2.87,-2.275; 9 2.87,-2.275; 10 2.87,-1.625; 11 2.87,-0.975; 12 2.87,-0.325; 13 2.87,0.325; 14 2.87,0.975; 15 2.87,1.625; 16 2.87,2.275 | smd 2.105 x 3.115: 17 0,0
SOIC127P600X175-8N = smd 1.981 x 0.559: 1 -2.464,1.905; 2 -2.464,0.635; 3 -2.464,-0.635; 4 -2.464,-1.905; 5 2.464,-1.905; 6 2.464,-0.635; 7 2.464,0.635; 8 2.464,1.905
QFN-24-EP = smd 1.016 x 0.254: 1 -2.066,1.257; 2 -2.066,0.75; 3 -2.066,0.247; 4 -2.066,-0.287; 5 -2.066,-0.792; 6 -2.066,-1.297; 13 2.086,-1.297; 14 2.086,-0.792; 15 2.086,-0.287; 16 2.086,0.247; 17 2.086,0.75; 18 2.086,1.257 | smd 0.254 x 1.016: 7 -1.267,-2.122; 8 -0.762,-2.122; 9 -0.258,-2.122; 10 0.278,-2.122; 11 0.78,-2.122; 12 1.287,-2.122; 19 1.287,2.082; 20 0.78,2.082; 21 0.278,2.082; 22 -0.258,2.082; 23 -0.762,2.082; 24 -1.267,2.082 | smd 2.616 x 2.616: P$1 0.02,-0.01
JST_CONNECTOR_FEMALE = drill 0.889: + 0,1; - 0,-1
TPS73633(SOT-23) = smd 0.55 x 1: EN 0.95,-1.35; GND 0,-1.35; IN -0.95,-1.35; NR/FB 0.95,1.35; OUT -0.95,1.35
TPS76850(SOIC-8) = smd 0.55 x 1.5: EN(BAR) -0.635,-2.7; FB/NC -0.635,2.7; GND -1.905,-2.7; IN1 0.635,-2.7; IN2 1.905,-2.7; OUT1 0.635,2.7; OUT2 1.905,2.7; PG -1.905,2.7
MY_MM_MOTOR_MOUNT = drill 0.95 pad 2: L_CHA -20.375,26.73; L_CHB -20.375,24.19; L_GND -20.375,45.27; L_MOTOR_A -2,37.27; L_MOTOR_B -2,34.73; L_VCC -20.375,47.81; R_CHA 20.375,45.27; R_CHB 20.375,47.81; R_GND 20.375,26.73; R_MOTOR_A 2,34.73; R_MOTOR_B 2,37.27; R_VCC 20.375,24.19 | hole 2.286: 14.85,45; 14.85,27; -14.85,27; -14.85,45

### Placement (x,y rotation side)
C1  40.19,45.36 0 top
C2  50.2,57.15 270 top
C3  55.1,16.45 180 top
C4  52.7,57.15 270 top
C5  4.11,13.86 180 top
C6  59.3,25.26 270 top
C7  62.35,46.5 180 bottom
C8  40.05,47.55 0 top
C9  72.5,37.25 270 top
C12  10.99,56.34 90 top
C13  17.98,46.3 180 top
C15  56.97,25.21 270 top
C16  58.85,33.68 90 top
C17  40.24,41.62 0 bottom
C18  40.26,43.72 180 bottom
C20  17.95,35.05 90 top
C21  63.9,53.75 270 top
C22  61.65,53.8 90 top
C23  62.25,49.1 0 bottom
C_3.3V1  12.2,37 180 top
C_3.3V2  12.2,39.25 180 top
C_5V1  6.9,33 0 top
C_5V2  8.45,29 0 top
C_BAT1  3.35,39.45 180 top
C_BAT2  2.85,34.25 270 top
C_E_H1  70.38,10.4 90 top
C_E_H2  73.4,13.15 90 top
C_ELF1  69.9,66.55 270 top
C_ELF2  73.39,62.79 180 top
C_EM_D1  84.22,42.67 90 top
C_EM_D2  84.09,48.58 270 top
C_ERF1  80.94,22.48 180 top
C_ERF2  80.89,20.25 180 top
C_GY_CP  14.6,23.65 270 top
C_GY_REG  25.3,31.45 270 top
C_GY_VDD  12.4,27.45 270 top
C_NR  10.3,32.4 180 top
CR1  53.91,47.16 0 top
D1  54.45,22.6 270 top
IC1  19.6,40.5 270 top
J1  68.04,50.28 270 top
J2  59.15,20.35 270 top
J4  64.6,42.7 90 top
JP1  40.95,36.6 270 top
JP3  41.4,28.65 90 top
L1  13.4,42.15 180 top
LED_PWR  8.3,53.15 90 top
LEFT_FRONT_EMITTER  59.52,70 275 top
NMOS1  56.43,66.62 0 top
NMOS2  75.14,30.12 270 top
NMOS3  54.61,10.88 90 top
NMOS4  71.42,24.68 270 top
R1  51.69,60.16 180 top
R2  50.94,15.04 90 top
R3  55.4,19.1 0 top
R8  47.41,30.95 0 top
R9  47.61,35.55 0 top
R_ED1  79.97,30.84 90 top
R_ED2  77.78,30.84 90 top
R_ED_PD  67.45,28.36 90 top
R_EH1  74.51,24.53 0 top
R_EH2  74.81,26.66 0 top
R_EH_PD  67.43,25.18 90 top
R_ELF  61.17,68.65 90 top
R_ELF_PD  54.34,62.66 0 top
R_ERF  55.8,8.37 0 top
R_ERF_PD  55.42,13.51 0 top
R_PWR  9.9,48.3 270 top
R_RLD  76.11,45.46 0 top
R_RLF  71.08,33.71 180 top
R_RLH  71.13,53.28 180 top
R_RRD  62.88,25.35 180 top
R_RRF  62.55,17.98 0 bottom
R_RRH  67,21.07 180 bottom
R_VM1  7.57,25.42 180 top
R_VM2  7.58,23.04 0 top
R_VM4  17.35,43.55 270 top
R_VM5  17.8,37.7 180 top
R_VM6  20.7,35.05 270 top
R_VM7  15.2,37 90 top
REC_LF  62.25,64.25 273 top
S1  6.86,6.1 0 top
S2  3.81,54.1 180 top
TP1  70.15,31 90 top
TP2  72.8,43.4 90 top
TP3  67.35,12.95 90 top
TP4  66.65,58.05 90 top
TP5  65.5,18.15 90 top
TP6  63.8,15.2 90 top
U1  66.94,31.04 0 top
U2  53.77,32.28 0 top
U3  14.87,51.96 0 top
U6  16.6,28.3 180 top
U$1  3.71,20.47 0 top
U$2  3.66,27.75 0 top
U$3  8.8,36.55 180 top
U$4  6.9,44.05 270 top
U$7  79,47 320 top
U$8  79,27 220 top
U$9  62.25,10.38 267 top
U$11  80,40 322 top
U$12  -3.94,37.63 270 top
U$13  59.91,5.02 265 top
U$17  80,34 218 top
U$18  76,52 0 top
U$19  76,22 180 top
U$20  70,18 180 top
U$21  70,56 0 top

### Tracks (layer width: path | path; a pad name or v marks a point on that pad's centre or on a via)
3.3V  (via drill 0.35)
  Top 0.254: U$3.OUT 10.25,35.2 11.4,34.05 12.2,34.05 | U6.13 12.2,29.6 | C_GY_VDD.1 12.2,28.5 12.2,29.6 | 12.2,29.6 12.2,34.05 | 12.2,34.05 12.2,36.15 C_3.3V1.1 C_3.3V2.1 | L1.1 13.4,39.6 C_3.3V2.1 | C_3.3V2.1 14.65,39.25 15.32,39.92 15.32,55.62 22.55,62.85 22.6,62.85 22.65,62.9 44.9,62.9 48.28,59.52 48.28,57.15 | 48.28,57.15 48.28,56.25 | 48.28,56.25 48.28,55.05 | 48.28,55.05 CR1.1 | 48.28,57.15 49.13,56.3 C2.2 | CR1.64 49.41,53.54 49.41,55.51 C2.2 | C4.2 C2.2 | J1.4 67.18,42.66 66.65,43.19 | 66.65,43.19 J4.2 | 66.65,43.19 66.65,51.87 65.62,52.9 C21.2 61.7,52.9 C22.1 | C22.1 61.57,52.95 CR1.48 | 48.28,55.05 46,52.77 46,50.7 42.85,47.55 C8.2 40.9,45.5 C1.2 46.46,45.36 46.9,44.91 CR1.13 | 48.28,56.25 48.03,56 v47.25,56 | v62.45,43.95 60.04,41.54 CR1.32 | v53.05,37.9 52.55,37.9 51.16,39.29 CR1.19 | v59.1,53.6 59.75,52.95 C22.1
  Bottom 0.254: v53.05,37.9 44.81,37.9 C17.1 41.09,43.7 C18.2 42.77,43.72 47.25,48.2 v47.25,56 49.65,53.6 v59.1,53.6 61.5,51.2 61.5,49.2 C23.2 61.4,46.6 C7.1 62.45,45.55 v62.45,43.95
5V  (via drill 0.35)
  Top 0.254: 9.75,40.05 9.75,41.99 U$4.OUT2 U$4.OUT1 11.46,43.41 13.03,44.98 | 9.75,40.05 U$3.IN | 9.75,40.05 7.85,40.05 | 7.85,40.05 6.9,40.05 6.05,39.2 C_5V1.1 6.05,29.8 C_5V2.1 6.85,27.4 7.25,27 8.5,27 18.24,17.26 U$12.R_VCC | R_PWR.2 10.45,47.45 11.65,46.25 11.75,46.25 13.03,44.98 | 13.03,44.98 14.4,46.35 14.4,54.6 | U$3.EN 7.85,40.05 | 14.4,54.6 14.4,56.05 22.65,64.3 50.5,64.3 51.1,64.9 51.1,66.3 | 51.1,66.3 51.1,70.85 52.95,72.7 58.9,72.7 | 58.9,72.7 59.6,72.7 69.78,69.97 71.3,68.45 | 71.3,68.45 74.38,65.38 | 74.38,65.38 79.44,60.31 80.75,57.49 | 80.75,57.49 82.69,53.34 82.69,52.58 | 73.1,9.55 69.88,6.33 U$13.+ 61.75,4.09 61.75,3.55 59.4,1.2 55.61,1.2 51.95,4.86 51.95,13.12 R2.1 48.26,14.14 v47.7,14.7 | 73.1,9.55 75.9,12.35 | 75.9,12.35 83.19,19.64 83.19,21.7 | LEFT_FRONT_EMITTER.+ 58.91,72.69 58.9,72.7 | U$18.+ 80.72,57.49 80.75,57.49 | 82.69,40.39 U$11.+ 78.8,40.28 v78.8,38.2 | 84.22,41.78 C_EM_D1.1 82.69,40.29 82.69,40.39 | C_ELF1.1 70.96,68.45 71.3,68.45 | C_ELF2.1 74.25,65.25 74.38,65.38 | 82.69,40.39 83.19,39.89 83.19,23.88 | 83.19,21.7 83.19,23.88 | C_EM_D2.1 84.09,51.18 82.69,52.58 | 82.69,40.39 82.69,52.58 | C_ERF1.1 83.19,23.88 | C_ERF2.1 83.19,21.7 | 75.9,12.35 73.44,12.35 C_E_H2.1 | 73.1,9.55 C_E_H1.1 | 14.4,54.6 13.4,55.6 v13.4,55.65 13.24,55.49 C12.1 | U3.8 17.4,53.93 | 17.4,53.93 v17.4,55.4 | IC1.5 19.15,43.21 19.15,43.8 | 17.4,53.93 17.97,53.93 18.15,53.75 18.35,53.75 20,52.1 20,44.65 19.15,43.8 | 19.15,43.8 18.55,44.4 R_VM4.1 | U2.12 56.64,31.85 | 56.64,31.85 56.64,31.35 | 56.64,31.35 U2.11 | C6.1 58.02,27.38 | 58.02,27.38 57.95,27.46 57.95,30.7 57.3,31.35 56.64,31.35 | 58.02,27.38 56.97,26.32 C15.1 56.97,26.21 56.76,26.15 v54.7,26.15
  Top 0.254: C16.1 58.43,33.26 U2.14 56.5,33.12 55.79,33.12 55.55,32.88 55.55,32.33 55.79,32.09 56.39,32.09 56.64,31.85 | U1.16 67.49,39.38 69.17,39.38 70.45,38.1 C9.1 v74.65,38.1 | v52.25,67.25 51.3,66.3 51.1,66.3 | U$12.L_VCC 46.01,58.01 v46.55,58.55
  Bottom 0.254: v13.4,55.65 17.15,55.65 v17.4,55.4 | v74.65,38.1 78.7,38.1 v78.8,38.2 | v46.55,58.55 46.6,58.55 52.25,64.2 v52.25,67.25 | v47.7,14.7 47.7,19.9 v54.7,26.15
(USART1)_RX
  Top 0.254: CR1.42 64.47,47.91 J4.3
(USART1)_TX
  Top 0.254: J4.4 62.69,48.41 CR1.43
A3.3V
  Top 0.254: L1.2 14.85,44.6 14.85,55.8 22.4,63.35 50.4,63.35 53.65,66.6 65.25,66.6 | 65.25,66.6 66.5,66.6 73.65,59.45 73.65,56.9 | REC_LF.C 65.25,66.39 65.25,66.6 | U$21.C 72.25,55.5 73.65,56.9 | 73.65,56.9 73.65,51.09 76.19,48.55 78.25,48.55 79.65,47.15 U$7.C 76.77,42.92 76.77,32.37 75.15,30.75 75.15,29.45 75.25,29.35 | U$8.C 77.71,26.89 75.25,29.35 | 75.25,29.35 74.95,29.05 74.95,28.99 74.01,28.05 73.45,28.05 71.35,25.95 71.35,21.12 U$20.C 68.73,16.65 65.15,13.07 65.15,11.65 62.64,9.14 U$9.C
AGND  (via drill 0.33)
  Top 0.254: U6.11 15.82,32.27 15.95,32.4 15.98,32.38 16.41,32.82 23.1,32.82 23.53,33.25 25.91,33.25 26.12,33.03 26.12,31.3 25.48,30.66 C_GY_REG.2 25.26,30.66 22.45,30.66 v21.59,31.52 | U2.13 57.45,32.6 59.65,30.4 61.5,30.4 61.75,30.65 | 61.75,30.65 U1.8 | 13.6,26.99 12.74,26.99 12.52,26.77 C_GY_VDD.2 | 13.6,26.99 14.46,26.99 U6.18 | 18.57,20.73 18.57,26.99 U6.1 18.78,26.99 19.43,26.99 v19.86,27.42 | 18.57,20.73 17.92,20.08 17.27,20.08 14.68,22.67 C_GY_CP.2 14.46,22.89 13.6,23.75 13.6,26.99 | 24.18,16.62 23.32,15.76 19,15.76 17.49,17.27 12.52,17.27 6.91,22.89 R_VM2.1 | 24.18,16.62 24.18,17.92 21.37,20.73 18.57,20.73 | v18.57,45.12 18.35,45.34 16.62,45.34 16.41,45.12 16.41,39.08 16.84,38.65 16.84,37.78 R_VM5.2 | v18.14,49.23 17.49,49.87 U3.5 | v63.91,23.32 63.91,25.26 R_RRD.1 | v62.4,30.01 61.75,30.65 | 61.75,30.66 61.75,30.65 | v73.84,35.62 72.11,33.9 R_RLF.1 | v74.27,44.48 75.13,45.34 R_RLD.1 75.13,45.55 72.11,48.58 72.11,53.11 R_RLH.1 | v39.73,16.62 24.18,16.62
  Bottom 0.254: v18.57,45.12 18.57,41.02 19,40.59 19.86,40.59 | 19.86,40.59 20.08,40.8 20.08,47.28 v18.14,49.23 | 19.86,40.59 21.59,38.86 v21.59,31.52 19.86,29.79 v19.86,27.42 | v62.4,30.01 62.4,24.83 v63.91,23.32 66.06,21.16 R_RRH.1 66.28,20.94 63.48,18.14 R_RRF.1 63.26,17.92 63.26,14.9 59.37,11.01 57.43,11.01 57.21,10.79 | v74.27,44.48 73.84,44.04 v73.84,35.62 73.62,35.41 73.62,17.92 63.69,7.99 59.16,7.99 57,10.15 57,10.58 57.21,10.79 | v39.73,16.62 45.55,10.79 57.21,10.79
BATT_CONN
  Top 0.254: 3.66,21.52 U$1.+
  Top 0.381: U$2.- 3.66,21.52
CURRENT_SENSE  (via drill 0.35)
  Top 0.254: C20.1 R_VM6.2 21.4,34.2 22.1,34.9 22.1,38.36 IC1.4 27.16,45.8 33.2,45.8 v33.3,45.7 | CR1.20 51.74,41.46 51.74,40.67 52.1,40.31 v52.1,39.55 | v37.35,39.95 v44,39.95
  Bottom 0.254: v52.1,39.55 52,39.45 51.63,39.45 50.77,40.31 46.5,40.31 45.94,39.75 44.2,39.75 v44,39.95 | v33.3,45.7 35.85,45.7 37.35,44.2 v37.35,39.95
D2_EM
  Top 0.254: 78.67,33.63 U$17.- 79.97,32.33 R_ED1.2 R_ED2.2
D_EM
  Top 0.254: U$11.- U$17.+
EM_D  (via drill 0.35)
  Top 0.254: NMOS2.G 72.57,30.77 71.01,29.21 R_ED_PD.2 67.36,29.36 65.63,29.36 v65.55,29.25 | v52.8,50.45 52.66,50.59 CR1.59
  Bottom 0.254: v65.55,29.25 65.55,37.8 57.06,46.29 54.98,46.29 54.59,46.68 54.59,48.76 52.91,50.44 v52.79,50.44 v52.8,50.45
EM_H  (via drill 0.35)
  Top 0.254: NMOS4.G 68.87,25.33 68.15,26.05 67.45,26.05 R_EH_PD.2 66.02,26.03 v65,27.05 | v50.2,50.95 51.16,51.91 CR1.62
  Bottom 0.254: v65,27.05 65,28.87 64.89,28.98 64.89,37.21 56.34,45.76 54.65,45.76 50.2,50.21 v50.2,50.95
EM_LF
  Top 0.254: CR1.58 53.16,53.85 55.18,55.87 55.18,62.6 R_ELF_PD.2 55.19,65.08 NMOS1.G
EM_RF  (via drill 0.35)
  Top 0.254: CR1.61 51.59,52.86 51.59,54.24 v52.05,54.7 | R_ERF_PD.2 56.77,13.01 56.77,11.45 56.78,11.45 NMOS3.G 57.73,10.23 v57.8,10.3
  Bottom 0.254: v57.8,10.3 65.3,10.3 72.8,17.8 72.8,49.53 68.27,54.06 68.24,54.06 67.6,54.7 v52.05,54.7
GND  (via drill 0.33, 0.35)
  Top 0.254: C_5V2.2 10.05,30.9 9.82,31.12 | 9.82,31.12 9.3,31.65 9.3,32.25 C_NR.2 | 9.82,31.12 9.82,31.05 v8.1,31.05 8.1,33 C_5V1.2 7.56,33.03 7.12,33.47 7.12,35.84 8.85,37.57 | C13.2 17.13,48.28 v17.35,48.5 | C6.2 59.16,24.4 57,24.4 C15.2 56.78,24.18 56.35,23.75 54.41,23.75 | 54.41,23.75 53.54,23.75 D1.1 53.33,23.75 v53.33,27.64 | 54.41,23.75 54.41,20.94 53.33,19.86 53.33,18.35 54.19,17.49 54.19,16.62 C3.2 54.41,16.41 54.41,13.6 R_ERF_PD.1 54.62,13.39 55.49,12.52 55.49,11.66 NMOS3.S 55.49,11.44 54.62,10.58 54.62,9.93 55.27,9.28 58.94,9.28 61.1,7.12 66.06,7.12 70.17,11.23 C_E_H1.2 70.38,11.44 70.81,11.44 73.19,13.82 C_E_H2.2 73.41,14.03 79.45,20.08 79.88,20.08 C_ERF2.2 80.1,20.3 80.1,22.45 C_ERF1.2 | NMOS4.S 70.38,24.18 67.58,24.18 R_EH_PD.1 67.36,24.4 66.71,24.4 64.34,26.77 64.34,27.42 64.77,27.85 67.14,27.85 67.36,27.64 R_ED_PD.1 67.58,27.64 70.17,27.64 71.89,29.36 v72.11,29.36 74.05,29.36 NMOS2.S | C22.2 61.75,54.62 63.69,54.62 C21.1 63.9,54.49 | v71.25,36.49 72.33,36.49 C9.2 | 63.91,54.41 63.9,54.49 | J1.1 68.01,50.3 68.01,51.17 65.38,53.8 v65.25,53.8 64.59,53.8 63.9,54.49 | C_BAT1.2 2.38,39.29 2.38,37.57 1.51,36.7 1.51,34.11 2.81,32.82 C_BAT2.2 3.02,32.6 v4.1,31.52 | 50.3,58.08 50.3,59.59 50.74,60.02 R1.2 | 50.3,58.08 52.68,58.08 C4.1 | 50.3,58.08 C2.1 | 51.82,61.32 52.03,61.32 53.33,62.61 R_ELF_PD.1 | 51.82,61.32 50.74,60.24 R1.2 | 8.85,55.05 8.42,54.62 LED_PWR.C 8.85,55.05 | 8.85,55.05 10.79,57 C12.2 | C_ELF1.2 69.74,65.63 72.54,62.83 C_ELF2.2 72.54,62.61 v72.54,61.75 | 8.85,37.57 8.85,37.78 U$3.GND 8.85,37.57 | 8.85,37.57 9.5,36.92 11.23,36.92 C_3.3V1.2 11.44,37.13 11.44,39.08 C_3.3V2.2
  Top 0.254: 84.2,46.63 84.2,47.71 C_EM_D2.2 | 84.2,46.63 84.2,43.61 C_EM_D1.2 | S1.2 8.85,5.4 4.97,5.4 S1.1 4.75,5.4 3.45,6.69 3.45,13.82 C5.2 3.45,14.03 3.45,19.21 3.67,19.43 U$1.- | U$4.EN(BAR) 4.1,44.69 4.1,45.77 U$4.GND 4.32,45.99 v8.2,45.99 | v55.92,64.55 57,65.63 NMOS1.S | v57.21,35.41 58.08,34.54 58.73,34.54 C16.2 | v19.43,41.24 18.78,40.59 18.35,40.59 IC1.2 | R8.1 46.42,30.87 45.34,29.79 v45.2,30 | v45.15,35.25 v45.16,35.25 45.54,35.55 R9.1 47.3,36.13 v47.3,38.65 | CR1.31 57.21,41.67 57.21,42.53 57.65,42.96 60.45,42.96 62.18,44.69 62.83,44.69 64.77,42.75 J4.1 | U$12.L_GND 41.24,57.86 39.29,55.92 39.29,47.71 C8.1 39.29,47.5 39.29,45.55 C1.1 40.2,44.5 42.25,44.5 v42.35,44.6 | v83.77,46.63 84.2,46.63 | v9.72,54.19 8.85,55.05 | v51.82,61.53 51.82,61.32 | CR1.47 59.6,50.48 60.39,50.48 61.05,51.15 v62.6,51.15 | R1.2 49.93,59.35 v49.35,59.35 | v50.6,38.65 50.6,41.48 CR1.18 | CR1.12 48.23,45.46 46.99,45.46 v46.35,46.1 46.3,46.05 v42.15,46.05
  Bottom 0.254: J1.1 68.22,50.09 69.74,48.58 69.74,36.92 70.17,36.49 v71.25,36.49 72.11,35.62 v72.11,29.36 | 48.8,59.8 45.55,56.57 42.75,56.57 41.45,57.86 U$12.L_GND | 48.8,59.8 51.17,62.18 | 51.17,62.18 53.54,64.55 v55.92,64.55 58.08,66.71 63.69,66.71 70.6,59.8 | v57.21,35.41 57.21,30.23 54.62,27.64 v53.33,27.64 47.5,27.64 45.34,29.79 v45.2,30 45.15,30.05 v45.15,35.25 | v19.43,41.24 19.43,46.42 17.49,48.36 v17.35,48.5 17.27,48.36 14.9,45.99 9.72,45.99 | 9.72,45.99 v8.2,45.99 | 70.6,59.8 v83.77,46.63 | 70.6,59.8 v72.54,61.75 | 9.72,45.99 v9.72,54.19 | 51.17,62.18 v51.82,61.53 | v4.1,31.52 7.56,31.52 7.99,31.09 v8.1,31.05 | 64.55,42.75 J4.1 | 64.47,42.83 64.55,42.75 | 64.55,42.75 64.55,43.53 63.35,44.72 63.35,46.34 C7.2 63.2,49 C23.1 62.6,49.6 v62.6,51.15 v65.25,53.8 | v49.35,59.35 48.9,59.8 48.8,59.8 | v42.35,44.6 42.27,44.52 40.43,44.52 39.63,43.72 C18.1 | v47.3,38.65 v50.6,38.65
  pour Top: 5,0 0,5 0,70 4.98,75 9.99,75 15,65 50,65 50,75 56,75 arc-90 86,45 86,30 arc-90 56,0 50,0 50,10 15,10 10,0
  pour Bottom: 0,70 0,5 5,0 10,0 15,10 50,10 50,0 56,0 arc90 86,30 86,45 arc90 56,75 50,75 50,65 15,65 9.99,75 4.98,75
H2_EM
  Top 0.254: U$19.- 74.73,23.89 R_EH1.2 75.36,26.36 R_EH2.2
H_EM
  Top 0.254: U$18.- 79.23,49.53 | 79.4,49.37 79.23,49.53 | U$19.+ 78.2,22.5 81.4,25.7 81.4,32.95 79.45,34.9 79.45,35.15 77.5,37.1 77.5,40.8 81.95,45.25 81.95,46.8 79.23,49.52 79.23,49.53
INT  (via drill 0.35)
  Top 0.254: U6.12 15.31,32.51 16.1,33.3 22.8,33.3 27.15,37.65 27.15,39.8 30.55,43.2 45.45,43.2 v46.4,44.15 | 56.24,41.46 CR1.29 56.08,41.62 56.08,42.4 55.75,42.73 53.59,42.73 53.22,43.1 v52.6,43.1
  Bottom 0.254: v46.4,44.15 49.14,44.15 51.5,46.51 52.17,46.51 52.86,45.82 52.86,45.48 52.6,45.22 v52.6,43.1
LEFT_MOTOR_H
  Top 0.254: U2.2 45.55,33.91 42.85,36.6 JP1.1 35.82,36.6 33.33,39.09 U$12.L_MOTOR_A
LEFT_MOTOR_L
  Top 0.254: U2.4 45.84,32.6 44.39,34.06 JP1.2 37.34,34.06 33.75,37.65 32.78,37.65 U$12.L_MOTOR_B
LF_EM
  Top 0.254: LEFT_FRONT_EMITTER.- 59.95,69.5 R_ELF.2
MUX_EN  (via drill 0.35)
  Top 0.254: 59.62,48.99 CR1.44 59.47,48.84 58.69,48.84 55.95,46.11 v55.95,45.05 | U1.7 62.03,32.2 60.35,32.2 59.85,31.7 v59.85,31.55
  Bottom 0.254: v55.95,45.05 56.05,45.05 58.6,42.5 58.6,32.75 59.8,31.55 v59.85,31.55
N$1
  Top 0.254: U3.6 18.23,51.32 18.83,50.72 C13.1
N$2
  Top 0.254: R3.1 54.45,19.55 55.55,20.65 D1.3 56,23.05 59.85,23.05 60.8,24 60.8,27.35 63.85,30.4 63.85,33.63 63.29,34.19 62.8,34.19 U1.5
N$5
  Top 0.254: NMOS3.D 53.66,9.66 R_ERF.1
N$7
  Top 0.254: R_ELF.1 60.95,67.57 NMOS1.D
N$9
  Top 0.254: R1.1 52.94,60.16 54.35,58.75 54.35,55.95 52.16,53.76 CR1.60
N$12
  Top 0.254: R2.2 50.9,15.98 U2.8
N$15
  Top 0.254: 50.8,33.26 U2.3 51.04,33.4 51.75,33.4 51.99,33.63 51.99,34.83 51.27,35.55 R9.2
N$18
  Top 0.254: R_ED1.1 R_ED2.1 76.21,29.99 NMOS2.D
N$19
  Top 0.254: R_EH2.1 73.66,26.36 R_EH1.1 72.52,24.53 NMOS4.D
N$20
  Top 0.254: U2.6 48.67,31.3 R8.2
N$21
  Top 0.254: R_VM5.1 16.9,39.27 16.9,40.94 17.34,41.38 | 17.34,41.38 17.41,41.45 IC1.1 | R_VM4.2 17.35,41.45 | 17.35,41.45 17.35,41.44 | 17.35,41.45 17.27,41.45 17.34,41.38
N$24
  Top 0.254: R_VM7.2 15.88,38.53 15.88,51.78 16.7,52.6 U3.7
N$26
  Top 0.254: U$3.NR/FB 9.6,33.45 10.2,33.45 11.15,32.5 C_NR.1
N$27
  Top 0.254: LED_PWR.A 9.9,50.05 R_PWR.1
N$28
  Top 0.254: U6.10 16.32,31.97 16.65,32.3 C_GY_REG.1
N$29
  Top 0.254: U6.20 15.76,26.12 15.76,25.48 14.68,24.4 C_GY_CP.1
N$31
  Top 0.254: R_VM7.1 15.5,35.85 16.45,35.85 16.5,35.9 C20.2 19.05,35.9 19.9,36.75 | IC1.3 19.05,39.55 19.9,38.7 19.9,36.75 | R_VM6.1 20.7,35.95 19.9,36.75
NRST  (via drill 0.35)
  Top 0.254: S1.3 8.81,6.9 6.8,8.9 6.55,8.9 | 4.81,7.11 S1.4 4.81,7.16 6.55,8.9 | 4.7,13.61 C5.1 5.76,13.86 6.58,13.05 | v43.75,46.95 46.54,46.95 47.43,47.84 48.22,47.84 CR1.7 | v10.05,16.55 10.05,16.52 6.58,13.05 | 6.55,8.9 6.55,13.02 6.58,13.05
  Bottom 0.254: v43.75,46.95 25.4,46.95 22.35,43.9 22.35,28.85 v10.05,16.55
PWM_MOTOR_1
  Top 0.254: U2.16 55.99,35.2 52.97,35.2 48.5,39.67 48.5,42.2 49.35,43.05 49.35,43.63 49.07,43.91 CR1.15
PWM_MOTOR_2
  Top 0.254: CR1.16 48.23,43.41 48.05,43.23 48.05,39.45 52.86,34.64 54.95,34.64 55.68,33.91 U2.15
PWM_MOTOR_3  (via drill 0.35)
  Top 0.254: CR1.26 54.66,40.62 56.18,39.1 57.55,39.1 57.9,39.45 v57.9,39.65 | v56.55,28.4 56.55,29.92 U2.9
  Bottom 0.254: v57.9,39.65 57.9,29.75 v56.55,28.4
PWM_MOTOR_4  (via drill 0.35)
  Top 0.254: 57.25,30.7 56.68,30.7 U2.10 56.5,30.52 55.79,30.52 55.55,30.28 55.55,29.57 54.38,28.4 v54.35,28.4 | CR1.27 55.16,40.73 55.94,39.95 v56.5,39.95
  Bottom 0.254: v56.5,39.95 56.5,30.55 v54.35,28.4
REC_LD
  Top 0.254: CR1.23 53.23,41.47 53.23,40.22 56.05,37.39 U1.3 63.04,37.39 63.6,37.95 63.6,39.75 64.55,40.7 68.46,40.7 69.36,39.8 74.85,39.8 74.9,39.85 74.9,41.8 | U$7.E 77.71,46.2 R_RLD.2 76.96,43.86 74.9,41.8 | 74.9,41.8 74.4,41.8 TP2.P$1
REC_LF  (via drill 0.35)
  Top 0.254: CR1.22 52.73,41.47 52.73,40.05 54.4,38.38 54.4,37.93 | 54.4,37.93 56.21,36.12 U1.4 65.17,36.12 65.78,35.51 68.42,35.51 R_RLF.2 70.15,33.63 TP1.P$1 | REC_LF.E v59.45,65.5 | v54.4,36.7 54.4,37.93
  Bottom 0.254: v59.45,65.5 51.4,57.45 47.2,57.45 46.05,56.3 46.05,47.8 43.55,45.3 39.45,45.3 37.8,43.65 37.8,40.95 39.1,39.65 42,39.65 45.05,36.6 54.3,36.6 v54.4,36.7
REC_LH  (via drill 0.35)
  Top 0.254: v70.5,37.15 67.17,37.15 U1.14 | R_RLH.2 68.12,53.28 v68,53.4 68.73,54.13 U$21.E 66.65,57.58 TP4.P$1 | v55.75,49.05 55.45,49.05 53.81,47.41 CR1.8
  Bottom 0.254: v70.5,37.15 70.5,50.9 v68,53.4 68,52.5 65.85,50.35 65.85,41.4 63.65,41.4 56,49.05 v55.75,49.05
REC_RD  (via drill 0.35)
  Top 0.254: U$8.E 79.65,26.6 76.05,23 76.05,18.7 65,7.65 61.2,7.65 59.98,8.88 | 59.98,8.88 59.9,8.95 | CR1.24 53.73,41.47 53.73,40.33 55.9,38.16 61.63,38.16 U1.2 60.74,38.66 v60.2,39.2 | 59.98,8.88 59.98,9.68 60.65,10.35 62.5,10.35 64.72,12.57 64.72,13.25 65.5,14.03 TP5.P$1 65.5,19.25 62.05,22.7 62.05,25.33 R_RRD.2 62.03,26.18 63.85,28 v63.85,28.15
  Bottom 0.254: v60.2,39.2 64.05,35.35 64.05,28.35 v63.85,28.15
REC_RF  (via drill 0.35)
  Top 0.254: CR1.25 54.19,41.51 54.19,40.47 56.04,38.63 58.28,38.63 59.59,39.93 | 59.59,39.93 U1.1 | U$9.E 61.77,11.72 61.77,13.93 61.75,13.95 v61.75,14.7 61.96,14.9 62.18,15.11 63.69,15.11 TP6.P$1 | 59.33,40.58 v59.3,40.55 59.59,40.27 59.59,39.93
  Bottom 0.254: 61.7,18.13 | 61.7,18.13 R_RRF.2 61.75,17.93 v61.75,14.7 | v59.3,40.55 59.3,35.7 61.7,33.3 61.7,18.13
REC_RH  (via drill 0.35)
  Top 0.254: v71.75,20.15 71.27,19.67 U$20.E 67.35,14.58 TP3.P$1 | v68.95,38.3 68.59,38.66 U1.15 | v55.25,46.95 55.04,46.91 CR1.9
  Bottom 0.254: v71.75,20.15 70.83,21.07 | 70.83,21.07 R_RRH.2 | 70.83,21.07 69.95,21.95 v69.85,21.95 68.95,22.85 v68.95,38.3 66,38.3 57.35,46.95 v55.25,46.95
RF_EM
  Top 0.254: U$13.- 59.3,4.14 57.51,5.93 56.66,6.79 R_ERF.2
RIGHT_MOTOR_H
  Top 0.254: U$12.R_MOTOR_A 37.78,28.65 JP3.1 47.6,28.65 49.6,30.66 U2.7
RIGHT_MOTOR_L
  Top 0.254: U$12.R_MOTOR_B 37.78,31.19 JP3.2 42.16,31.95 U2.5
SENSOR_DEBUG
  Top 0.254: J2.4 59.15,13.25 C3.1 55.95,18.7 R3.2
SPI2_MISO  (via drill 0.35)
  Top 0.254: U6.9 16.86,31.66 17.03,31.83 18.92,31.83 20.3,30.45 20.3,29.2 21.6,27.9 25.65,27.9 27.8,30.05 27.8,39.5 30.55,42.25 v44.2,42.25 | CR1.35 58.66,44.41 58.15,43.9 53.65,43.9 52.8,44.75 v51.6,44.75
  Bottom 0.254: v51.6,44.75 51.35,44.75 48.85,42.25 v44.2,42.25
SPI2_MOSI  (via drill 0.35)
  Top 0.254: CR1.36 58.11,44.91 57.55,44.35 54.45,44.35 53.05,45.75 v52,45.75 | v44.3,43.9 36.3,43.9 v36.2,44 | U6.24 17.87,20.97 v17.85,20.95
  Bottom 0.254: v52,45.75 51.35,45.75 48.35,42.75 45.45,42.75 v44.3,43.9 | v36.2,44 36.2,34.4 27.35,25.55 21.85,25.55 17.85,21.55 v17.85,20.95
SPI2_NSS  (via drill 0.35)
  Top 0.254: U6.8 17.36,31.31 17.45,31.4 18.4,31.4 19.65,30.15 19.65,28.75 21.25,27.15 26.7,27.15 28.45,28.9 28.45,39.2 30.4,41.15 45.25,41.15 v45.3,41.1 | CR1.33 59.49,43.46 53.47,43.46 52.76,44.17 52.17,44.17 51.35,43.35 v51.1,43.35
  Bottom 0.254: v51.1,43.35 50.6,43.35 48.35,41.1 v45.3,41.1
SWCLK
  Top 0.254: J1.2 69.49,49.19 69.49,50.74 63.73,56.5 60.37,56.5 57.66,53.79 CR1.49
V_BATT
  Top 0.254: S2.2 3.7,54 | 3.7,54 2.4,52.69 2.4,44.3 3.15,43.55 | 3.15,43.55 | 3.15,43.55 3.29,43.41 U$4.IN1 U$4.IN2 C_BAT1.1 4.2,37.2 | C_BAT2.1 4.2,37.2 | 3.7,54 4.9,52.8 9,52.8 11.71,50.09 12.37,50.09 U3.4 12.99,50.05 13.85,50.91 13.85,51.73 12.97,52.6 12.42,52.6 U3.2 | R_VM1.2 4.85,27.28 4.85,36.55 4.2,37.2
V_BATT_POWER
  Top 0.254: S2.3 3.76,56.59 | 3.76,56.59 1,53.83 1,31.42 U$2.+ | 3.76,56.59 7.12,53.23 9.53,53.23 10.38,52.38 | U3.3 11.44,51.32 10.38,52.38 | 10.38,52.38 11.86,53.86 U3.1
VBAT_SENSE  (via drill 0.35)
  Top 0.254: v35.2,38.8 v45,38.8 | v14.25,19.15 10.36,23.04 R_VM2.2 8.42,23.1 8.42,25.26 R_VM1.1 | v49.65,39.6 50.16,40.11 CR1.17
  Bottom 0.254: v49.65,39.6 46.95,39.6 46,38.65 45.12,38.65 v45,38.8 | v35.2,38.8 33.95,37.55 28.15,37.55 23.25,32.65 23.25,28.15 v14.25,19.15

### Text on the board
tPlace: SN74HC15 | MUX | DRV8848 | ACS712
Document: Notes / ----------------------- / Bottom layer - GND / Add net classes / Add power planes / Use vector font